# EAGLE board PixHawk_Fire_v1.1 (EAGLE 6.5.0), part 1 of 2
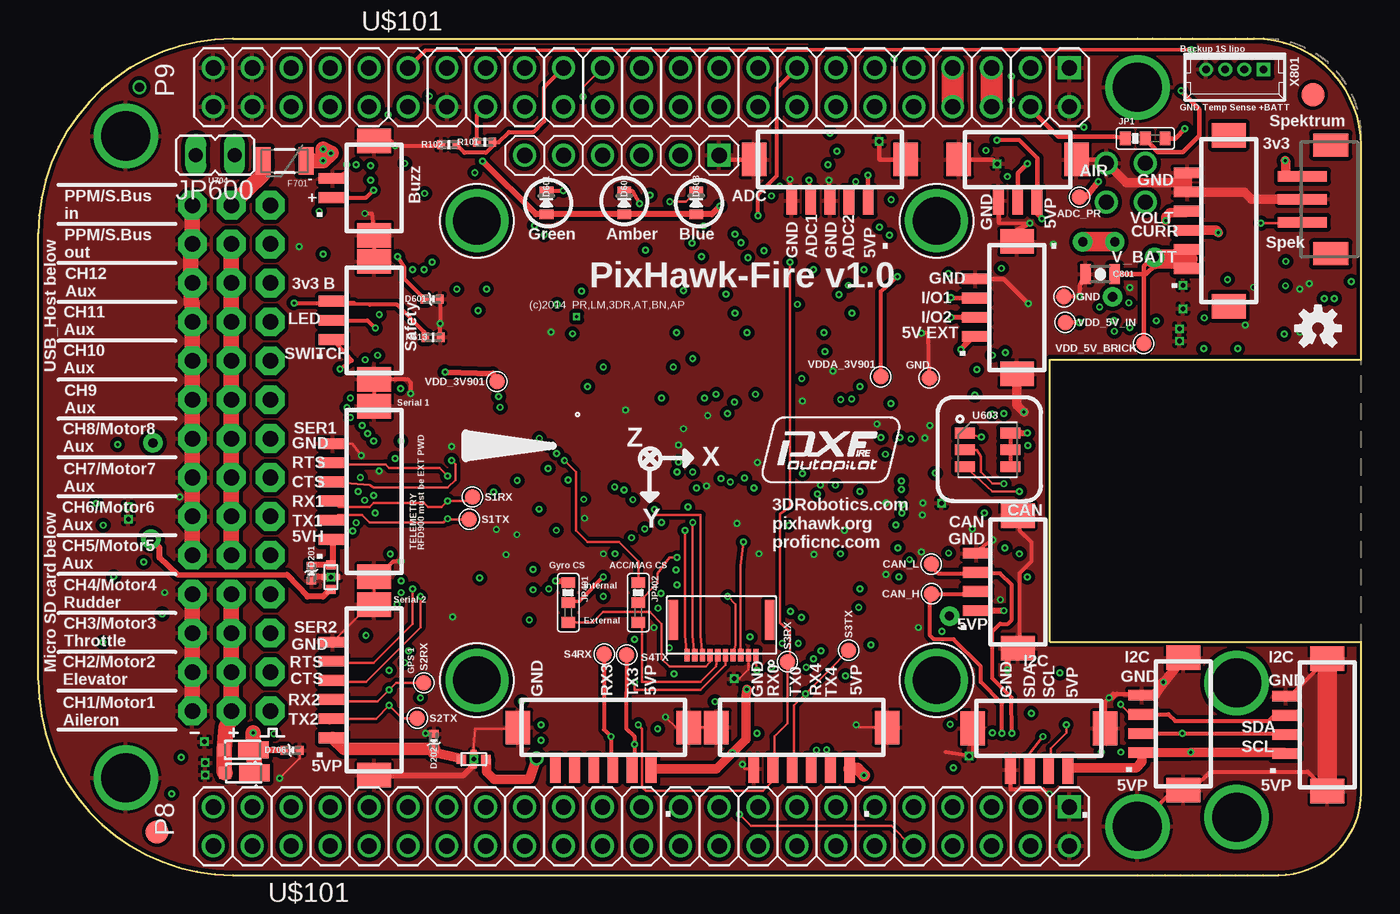
[diagram p9: board, top side]
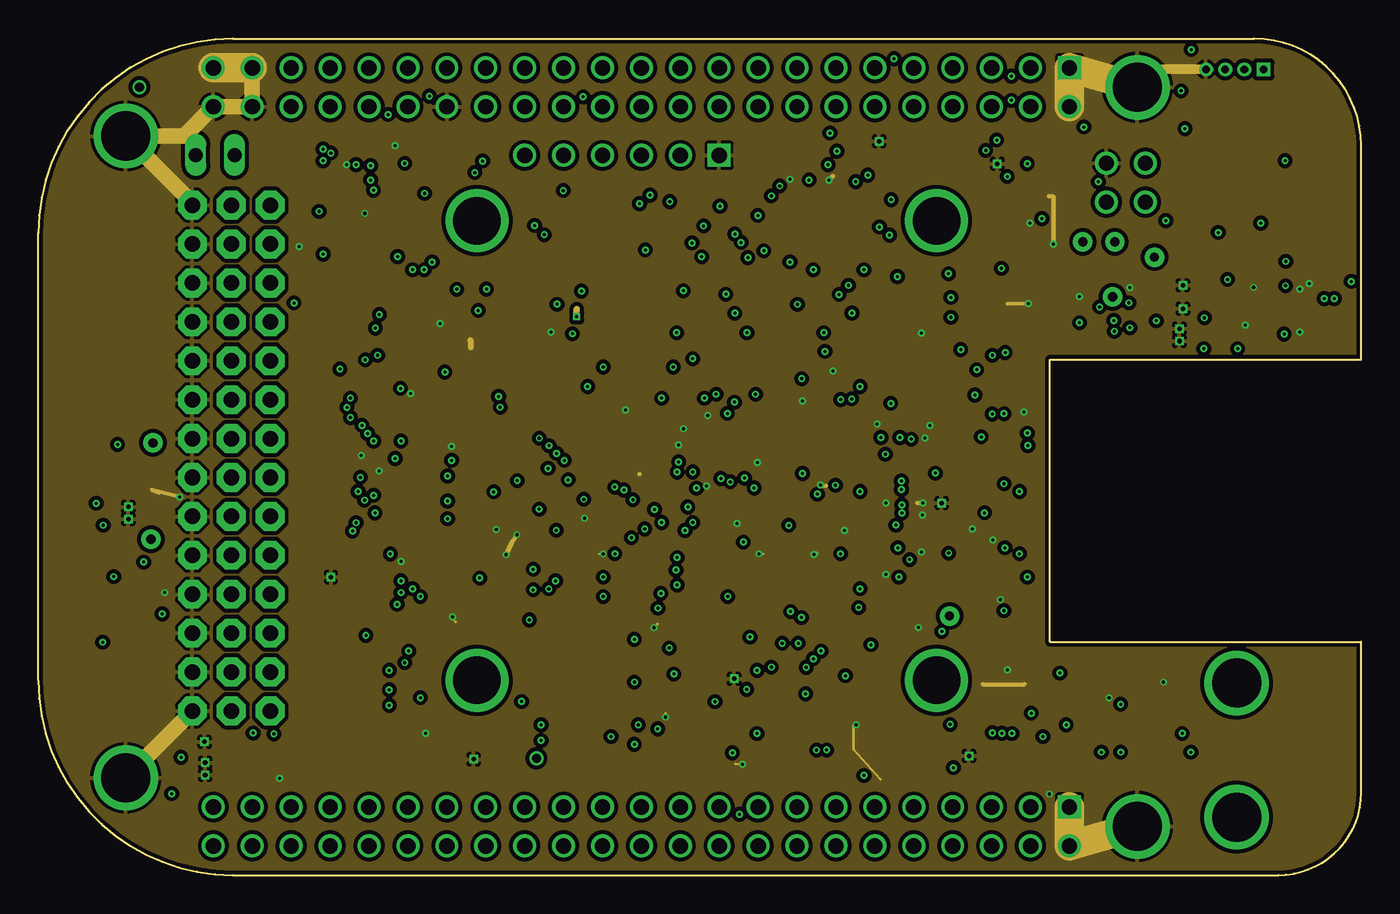
[diagram p10: board, inner layer Ground]
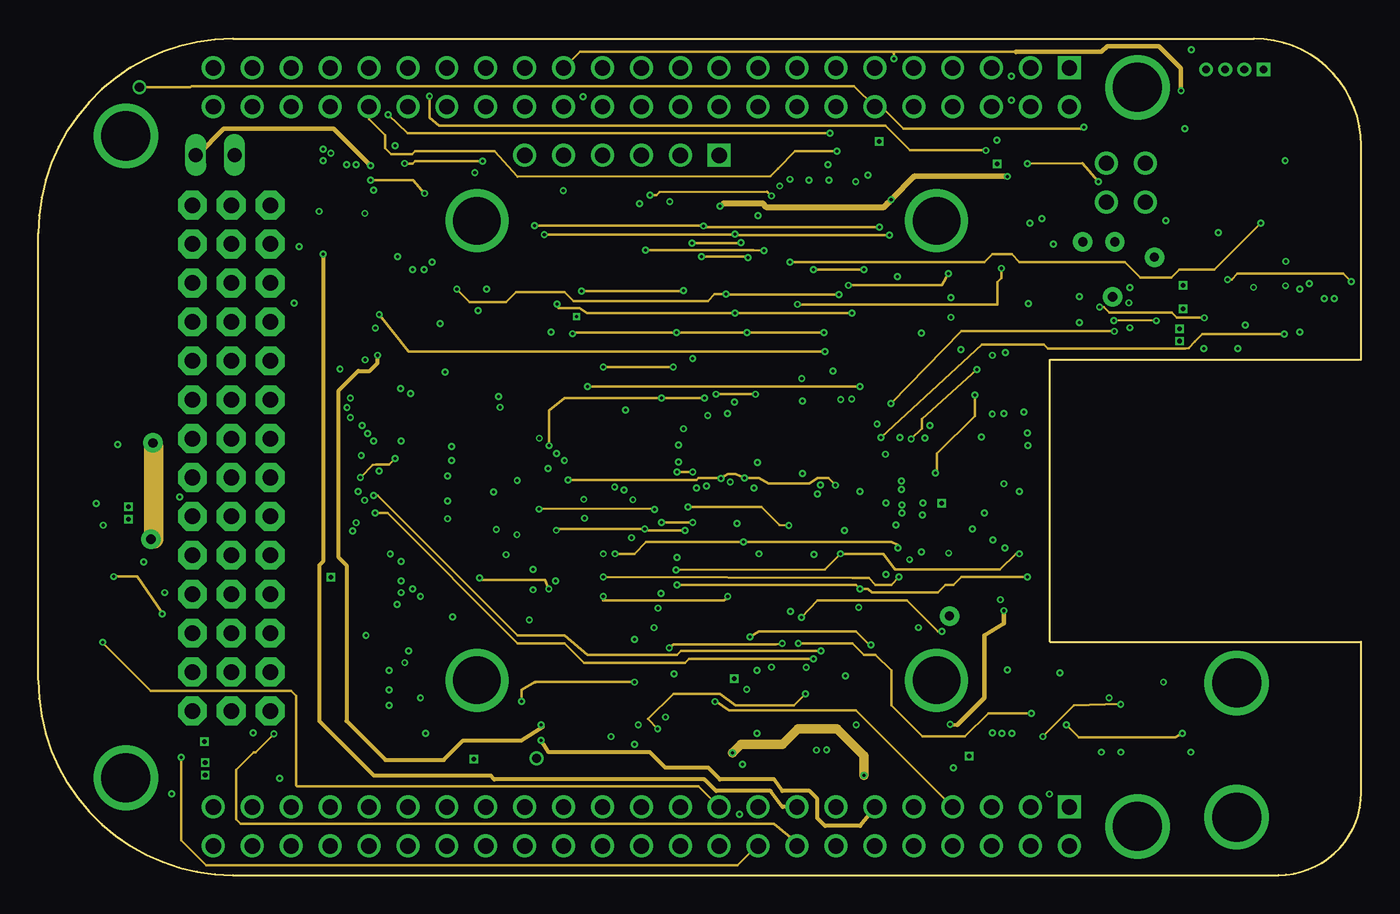
[diagram p11: board, inner layer Horizontal]
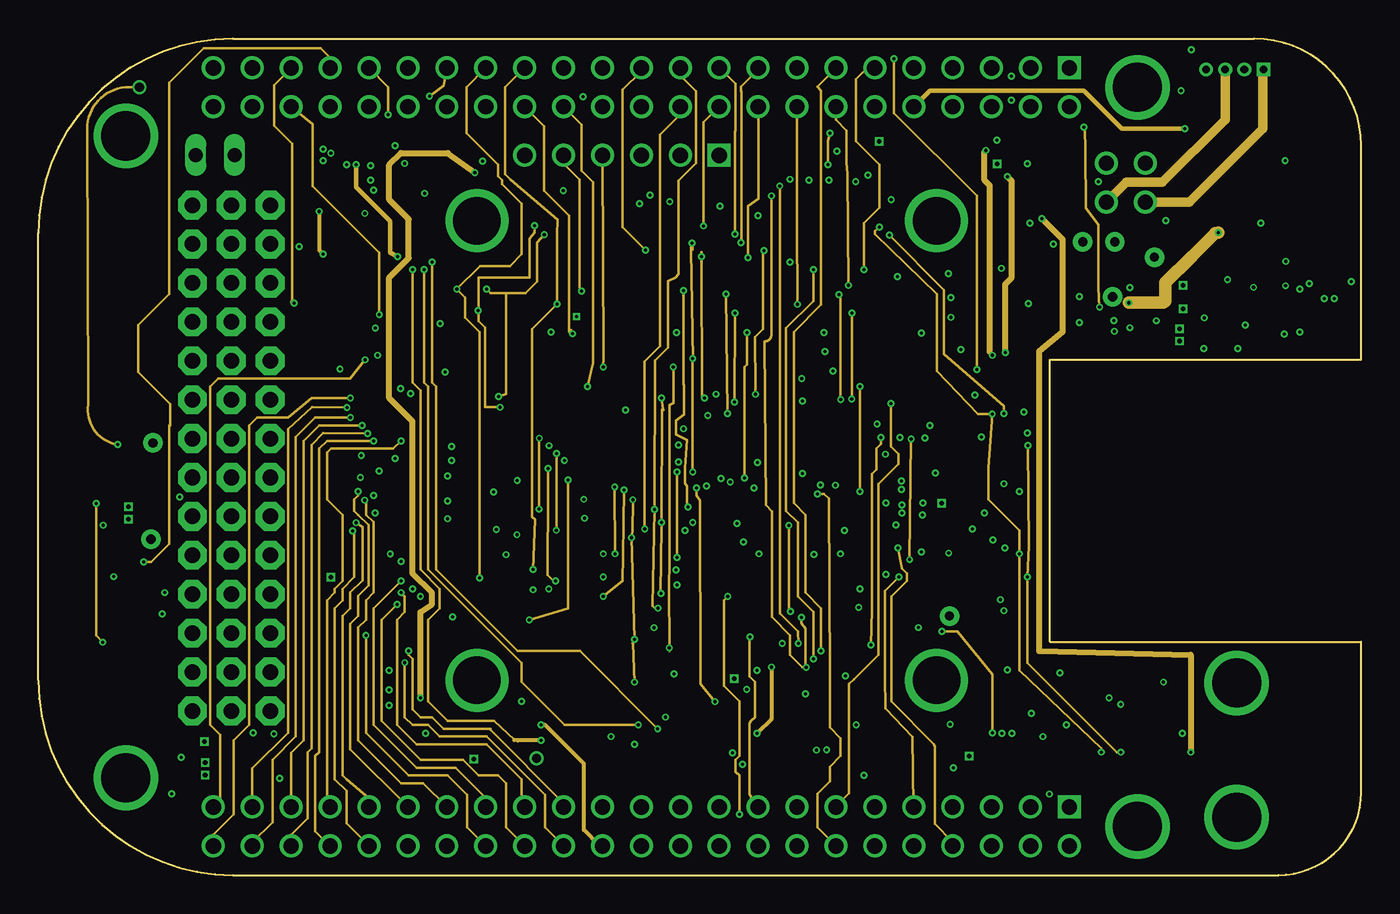
[diagram p12: board, inner layer Vertical]
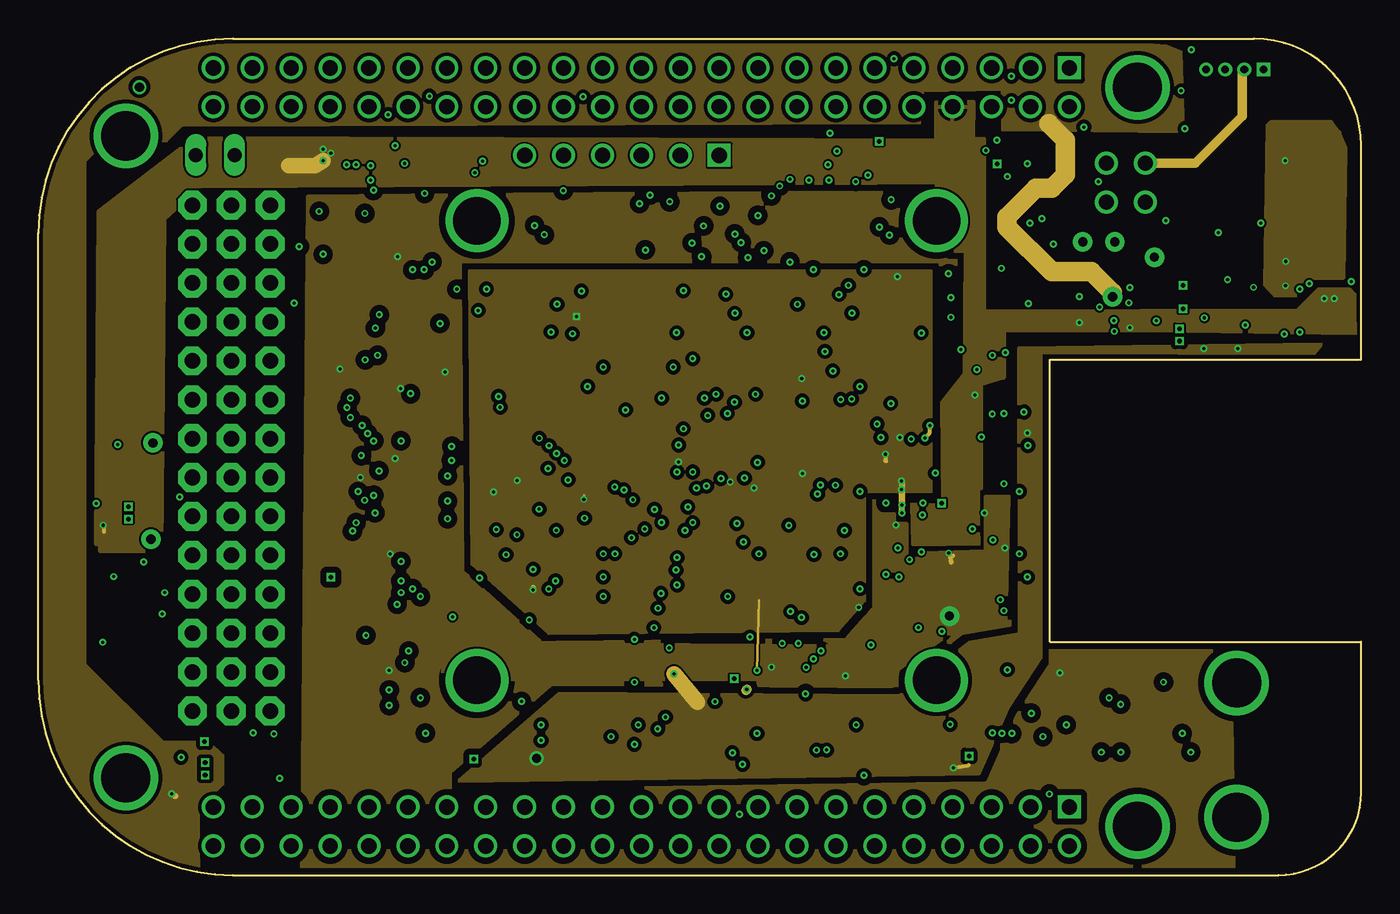
[diagram p13: board, inner layer Power]
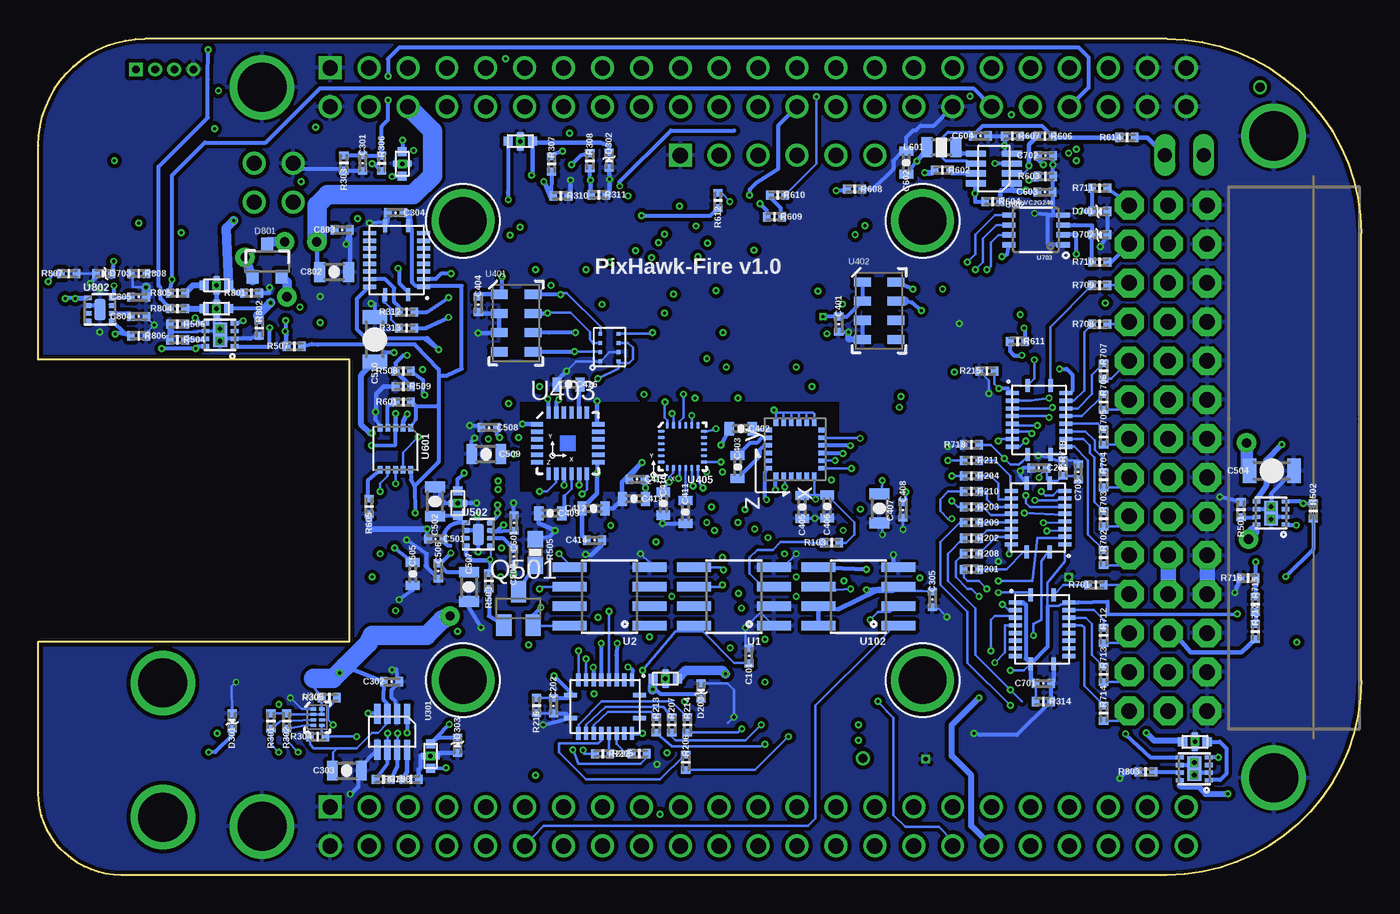
[diagram p14: board, bottom side, seen from below]

Size 86.36 x 54.61 mm. Coordinates in mm from the lower left corner, seen from the top.
Copper layers (1*2*3*14*15*16): Top 0.035mm / dielectric 0.5mm / Ground 0.035mm / dielectric 0.15mm / Horizontal 0.035mm / dielectric 0.15mm / Vertical 0.035mm / dielectric 0.15mm / Power 0.035mm / dielectric 0.5mm / Bottom 0.035mm
Design rules "3DR 5mil *": minimum track width 0.125mm, minimum drill 0.15mm, track to track 4mil, track to pad 4mil, pad to pad 4mil, via to via 4mil, smd to smd 1mil, copper to edge 0.125mm, drill to drill 0.125mm, minimum pad ring 0.125mm, minimum via ring 0.125mm, stop-mask expansion 1mil, vias tented up to drill 0.31mm, thermal gap 8mil
Net classes: 0 signal: width 0.127 mm, drill 0.2 mm, clearance 0.127 mm; 1 power: width 0.127 mm, drill 0.2 mm, clearance 0.127 mm

## Footprints (pad centres in the part's own frame; a part is rotated, then mirrored left to right if it is on the bottom)
PAD.04X.04 = smd 1.016 x 1.016: P$1 0,0
0402-CAP = smd 0.5 x 0.6: P$1 -0.5,0; P$2 0.5,0
0805-CAP = smd 0.7 x 1.3: P$1 -0.95,0; P$2 0.95,0
0603-CAP = smd 0.6 x 0.9: P$1 -0.75,0; P$2 0.75,0
1206-CAP = smd 0.9 x 1.6: P$1 -1.45,0; P$2 1.45,0
0402-TVS = smd 0.5 x 0.6: A 0.5,0; C -0.5,0
MICROSMP = smd 0.8 x 0.8: ANODE 0.65,0 | smd 2 x 1.1: CATHODE -1.25,0
SOT23-3 = smd 0.8 x 0.9: 1 -0.95,-1; 2 0.95,-1; 3 0,1.1
PTC-1206 = smd 1 x 1.8: 1 -1.4,0; 2 1.4,0
51281-1094 = smd 0.34 x 0.8: 1 0,0; 2 0.5,0; 3 1,0; 4 1.5,0; 5 2,0; 6 2.5,0; 7 3,0; 8 3.5,0; 9 4,0; 10 4.5,0 | smd 0.6 x 2.6: P$11 -0.9,-2.3; P$12 5.4,-2.3
DF13C-3P-1.25V = smd 0.7 x 1.8: 1 -1.25,0.9; 2 0,0.9; 3 1.25,0.9 | smd 1.6 x 2.2: P$4 -3.85,-1.8; P$5 3.85,-1.8
DF13C-4P-1.25V = smd 0.7 x 1.8: 1 -1.875,0.9; 2 -0.625,0.9; 3 0.625,0.9; 4 1.875,0.9 | smd 1.6 x 2.2: P$5 -4.325,-1.8; P$6 4.325,-1.8
DF13C-5P-1.25V = smd 0.7 x 1.8: 1 -2.5,0.9; 2 -1.25,0.9; 3 0,0.9; 4 1.25,0.9; 5 2.5,0.9 | smd 1.6 x 2.2: P$6 -4.95,-1.8; P$7 4.95,-1.8
JST-ZH-SMT-VERTICAL = smd 0.7 x 3.2: P$1 -1.5,-1.75; P$2 0,-1.75; P$3 1.5,-1.75 | smd 1.5 x 2.3: P$4 3.55,0.1; P$5 -3.55,0.1
DF13C-6P-1.25V = smd 0.7 x 1.8: 1 -3.125,0.9; 2 -1.875,0.9; 3 -0.625,0.9; 4 0.625,0.9; 5 1.875,0.9; 6 3.125,0.9 | smd 1.6 x 2.2: M$0 5.575,-1.8; M$1 -5.575,-1.8
SJ_3_0603_PASTE1&2 = smd 0.7 x 0.9: 1 -0.65,0; 2 0.65,0; 3 1.95,0
JP1 = drill 0.914 long: 1 0,-1.27; 2 0,1.27
FIDUCIAL-1.5X3 = smd 1.5 x 1.5: 1 0,0
KYOCERA-KNH16-DA = smd 0.6 x 0.6: P$1 -0.8,0; P$2 0.8,0 | smd 0.4 x 0.4: P$3 0,-0.4; P$4 0,0.4 | drill 0.3 pad 0.4 square: P$5 0,0
0805-IND = smd 0.7 x 1.3: P$1 -0.95,0; P$2 0.95,0
0603-LED = smd 0.6 x 0.9: A 0.75,0; C -0.75,0
MOUNT-HOLE3.1 = drill 3.1 pad 4.1: P$1 0,0
SOT23-BEC = smd 1 x 1.4: B -0.95,-1.1; C 0,1.1; E 0.95,-1.1
0402-RES = smd 0.5 x 0.6: P$1 -0.5,0; P$2 0.5,0
0603-RES = smd 1.1 x 1: 1 -0.85,0; 2 0.85,0
SO08 = smd 0.61 x 2.21: 1 -1.905,-2.616; 2 -0.635,-2.616; 3 0.635,-2.616; 4 1.905,-2.616; 5 1.905,2.616; 6 0.635,2.616; 7 -0.635,2.616; 8 -1.905,2.616
QFN20-RGY = smd 0.28 x 0.85: 1 -0.75,2.25; 10 -0.75,-2.25; 11 0.75,-2.25; 20 0.75,2.25 | smd 0.85 x 0.28: 2 -1.75,1.75; 3 -1.75,1.25; 4 -1.75,0.75; 5 -1.75,0.25; 6 -1.75,-0.25; 7 -1.75,-0.75; 8 -1.75,-1.25; 9 -1.75,-1.75; 12 1.75,-1.75; 13 1.75,-1.25; 14 1.75,-0.75; 15 1.75,-0.25; 16 1.75,0.25; 17 1.75,0.75; 18 1.75,1.25; 19 1.75,1.75
SOT23-8 = smd 0.42 x 1.3: 1 -0.975,-1.175; 2 -0.325,-1.175; 3 0.325,-1.175; 4 0.975,-1.175; 5 0.975,1.175; 6 0.325,1.175; 7 -0.325,1.175; 8 -0.975,1.175
PCA9306 = smd 0.35 x 0.2: 1 -0.275,0.525; 2 -0.275,0.175; 3 -0.275,-0.175; 4 -0.275,-0.525; 5 0.275,-0.525; 6 0.275,-0.175; 7 0.275,0.175; 8 0.275,0.525
MS5611-01BA = smd 1.1 x 0.6: 1 -1.1,1.875; 2 -1.1,0.625; 3 -1.1,-0.625; 4 -1.1,-1.875; 5 1.1,-1.875; 6 1.1,-0.625; 7 1.1,0.625; 8 1.1,1.875
QFN-24 = smd 0.8 x 0.29: 1 -2,1.25; 2 -2,0.75; 3 -2,0.25; 4 -2,-0.25; 5 -2,-0.75; 6 -2,-1.25; 13 2,-1.25; 14 2,-0.75; 15 2,-0.25; 16 2,0.25; 17 2,0.75; 18 2,1.25 | smd 0.29 x 0.8: 7 -1.25,-2; 8 -0.75,-2; 9 -0.25,-2; 10 0.25,-2; 11 0.75,-2; 12 1.25,-2; 19 1.25,2; 20 0.75,2; 21 0.25,2; 22 -0.25,2; 23 -0.75,2; 24 -1.25,2
MPU-6500 = smd 0.45 x 0.22: 1 -1.4,1; 2 -1.4,0.6; 3 -1.4,0.2; 4 -1.4,-0.2; 5 -1.4,-0.6; 6 -1.4,-1; 13 1.4,-1; 14 1.4,-0.6; 15 1.4,-0.2; 16 1.4,0.2; 17 1.4,0.6; 18 1.4,1 | smd 0.22 x 0.45: 7 -1,-1.4; 8 -0.6,-1.4; 9 -0.2,-1.4; 10 0.2,-1.4; 11 0.6,-1.4; 12 1,-1.4; 19 1,1.4; 20 0.6,1.4; 21 0.2,1.4; 22 -0.2,1.4; 23 -0.6,1.4; 24 -1,1.4
LSM9DS0 = smd 0.45 x 0.3: 1 -1.75,1.25; 2 -1.75,0.75; 3 -1.75,0.25; 4 -1.75,-0.25; 5 -1.75,-0.75; 6 -1.75,-1.25; 13 1.75,-1.25; 14 1.75,-0.75; 15 1.75,-0.25; 16 1.75,0.25; 17 1.75,0.75; 18 1.75,1.25 | smd 0.3 x 0.45: 7 -1.25,-1.75; 8 -0.75,-1.75; 9 -0.25,-1.75; 10 0.25,-1.75; 11 0.75,-1.75; 12 1.25,-1.75; 19 1.25,1.75; 20 0.75,1.75; 21 0.25,1.75; 22 -0.25,1.75; 23 -0.75,1.75; 24 -1.25,1.75
BMP280_PRELIM = smd 0.25 x 0.25: P$1 0.6,0.9; P$2 0.6,0.3; P$3 0.6,-0.3; P$4 0.6,-0.9; P$5 -0.6,-0.9; P$6 -0.6,-0.3; P$7 -0.6,0.3; P$8 -0.6,0.9
QFN8-DSG = smd 0.28 x 0.5: 1 -0.75,-0.95; 2 -0.25,-0.95; 3 0.25,-0.95; 4 0.75,-0.95; 5 0.75,0.95; 6 0.25,0.95; 7 -0.25,0.95; 8 -0.75,0.95 | smd 1.6 x 0.9: GND 0,0 | drill 0.3 square: P$2 -0.4,0; P$3 0.4,0
MLF-8-EPAD = smd 0.5 x 0.3: 1 -0.8,0.75; 2 -0.8,0.25; 3 -0.8,-0.25; 4 -0.8,-0.75; 5 0.8,-0.75; 6 0.8,-0.25; 7 0.8,0.25; 8 0.8,0.75 | smd 0.7 x 1.4: GND 0,0
SON10 = smd 0.32 x 0.5: 1 -1,-1.375; 2 -0.5,-1.375; 3 0,-1.375; 4 0.5,-1.375; 5 1,-1.375; 6 1,1.375; 7 0.5,1.375; 8 0,1.375; 9 -0.5,1.375; 10 -1,1.375
6-PLCC = smd 1.3 x 0.7: A1 1.475,1.1; A2 1.475,0; A3 1.475,-1.1; C1 -1.475,1.1; C2 -1.475,0; C3 -1.475,-1.1
TSSOP8_SOT505-2 = smd 0.35 x 0.85: 1 -0.975,-1.775; 2 -0.325,-1.775; 3 0.325,-1.775; 4 0.975,-1.775; 5 0.975,1.775; 6 0.325,1.775; 7 -0.325,1.775; 8 -0.975,1.775
3X14RA = drill 1.016 pad 1.88 octagon: 1 2.54,-16.51; 2 0,-16.51; 3 -2.54,-16.51; 4 2.54,-13.97; 5 0,-13.97; 6 -2.54,-13.97; 7 2.54,-11.43; 8 0,-11.43; 9 -2.54,-11.43; 10 2.54,-8.89; 11 0,-8.89; 12 -2.54,-8.89; 13 2.54,-6.35; 14 0,-6.35; 15 -2.54,-6.35; 16 2.54,-3.81; 17 0,-3.81; 18 -2.54,-3.81; 19 2.54,-1.27; 20 0,-1.27; 21 -2.54,-1.27; 22 2.54,1.27; 23 0,1.27; 24 -2.54,1.27; 25 2.54,3.81; 26 0,3.81; 27 -2.54,3.81; 28 2.54,6.35; 29 0,6.35; 30 -2.54,6.35; 31 2.54,8.89; 32 0,8.89; 33 -2.54,8.89; 34 2.54,11.43; 35 0,11.43; 36 -2.54,11.43; 37 2.54,13.97; 38 0,13.97; 39 -2.54,13.97; 40 2.54,16.51; 41 0,16.51; 42 -2.54,16.51
DF13C-6P-1.25V' = smd 0.7 x 1.8: 1 -3.125,0.9; 2 -1.875,0.9; 3 -0.625,0.9; 4 0.625,0.9; 5 1.875,0.9; 6 3.125,0.9 | smd 1.6 x 2.2: P$7 -5.575,-1.8; P$8 5.575,-1.8
DF13C-2P-1.25V = smd 0.7 x 1.8: 1 -0.625,0.9; 2 0.625,0.9 | smd 1.6 x 2.2: P$3 -3.075,-1.8; P$4 3.075,-1.8
BEAGLEBONE_SHIELD = drill 1 square: 1 4.445,19.05; 47 52.705,19.05; 93 46.99,41.91 | drill 1: 2 1.905,19.05; 3 4.445,21.59; 4 1.905,21.59; 5 4.445,24.13; 6 1.905,24.13; 7 4.445,26.67; 8 1.905,26.67; 9 4.445,29.21; 10 1.905,29.21; 11 4.445,31.75; 12 1.905,31.75; 13 4.445,34.29; 14 1.905,34.29; 15 4.445,36.83; 16 1.905,36.83; 17 4.445,39.37; 18 1.905,39.37; 19 4.445,41.91; 20 1.905,41.91; 21 4.445,44.45; 22 1.905,44.45; 23 4.445,46.99; 24 1.905,46.99; 25 4.445,49.53; 26 1.905,49.53; 27 4.445,52.07; 28 1.905,52.07; 29 4.445,54.61; 30 1.905,54.61; 31 4.445,57.15; 32 1.905,57.15; 33 4.445,59.69; 34 1.905,59.69; 35 4.445,62.23; 36 1.905,62.23; 37 4.445,64.77; 38 1.905,64.77; 39 4.445,67.31; 40 1.905,67.31; 41 4.445,69.85; 42 1.905,69.85; 43 4.445,72.39; 44 1.905,72.39; 45 4.445,74.93; 46 1.905,74.93; 48 50.165,19.05; 49 52.705,21.59; 50 50.165,21.59; 51 52.705,24.13; 52 50.165,24.13; 53 52.705,26.67; 54 50.165,26.67; 55 52.705,29.21; 56 50.165,29.21; 57 52.705,31.75; 58 50.165,31.75; 59 52.705,34.29; 60 50.165,34.29; 61 52.705,36.83; 62 50.165,36.83; 63 52.705,39.37; 64 50.165,39.37; 65 52.705,41.91; 66 50.165,41.91; 67 52.705,44.45; 68 50.165,44.45; 69 52.705,46.99; 70 50.165,46.99; 71 52.705,49.53; 72 50.165,49.53; 73 52.705,52.07; 74 50.165,52.07; 75 52.705,54.61; 76 50.165,54.61; 77 52.705,57.15; 78 50.165,57.15; 79 52.705,59.69; 80 50.165,59.69; 81 52.705,62.23; 82 50.165,62.23; 83 52.705,64.77; 84 50.165,64.77; 85 52.705,67.31; 86 50.165,67.31; 87 52.705,69.85; 88 50.165,69.85; 89 52.705,72.39; 90 50.165,72.39; 91 52.705,74.93; 92 50.165,74.93; 94 46.99,44.45; 95 46.99,46.99; 96 46.99,49.53; 97 46.99,52.07; 98 46.99,54.61; TP5 43.942,14.097; TP6 46.482,14.097; TP7 43.942,16.637; TP8 46.482,16.637 | drill 3.2: P$1 6.35,80.645; P$2 48.26,80.645; P$3 3.175,14.605; P$4 51.435,14.605 | drill 3.2 pad 3.81: P$5 12.54,8.128; P$6 3.78,8.128
53047-04 = drill 0.5 pad 0.9 square: 1 -1.875,0 | drill 0.5 pad 0.9: 2 -0.625,0; 3 0.625,0; 4 1.875,0

## Placement (x,y rotation side)
ADC_PR  PAD.04  [PAD.04X.04]  67.97,44.26 90 top
C101  0u1  [0402-CAP]  39.96,14.32 90 bottom
C201  0u1  [0402-CAP]  21.03,26.59 180 bottom
C202  0u1  [0402-CAP]  52.73,11.06 270 bottom
C301  0u1  [0402-CAP]  65.19,46.48 270 bottom
C302  0u1  [0402-CAP]  63.29,12.63 0 bottom
C303  10u/10V  [0805-CAP]  66.22,6.82 0 bottom
C304  0u1  [0402-CAP]  63.03,43.24 180 bottom
C305  0u1  [0402-CAP]  27.99,18 270 bottom
C401  0u1  [0402-CAP]  34.11,35.96 270 bottom
C402  4.7u  [0603-CAP]  40.5,29.14 180 bottom
C403  0.22u  [0603-CAP]  40.71,26.65 270 bottom
C404  0u1  [0402-CAP]  57.64,37.26 270 bottom
C405  0u1  [0603-CAP]  36.49,24.04 90 bottom
C406  10u  [0603-CAP]  34.86,24.06 90 bottom
C407  10u/10V  [0805-CAP]  31.45,23.94 270 bottom
C408  0u1  [0402-CAP]  29.91,23.84 270 bottom
C409  2200p  [0603-CAP]  52.94,23.61 180 bottom
C410  10n  [0603-CAP]  45.56,24.25 270 bottom
C411  2200p  [0603-CAP]  44.12,23.71 270 bottom
C412  2u2  [0603-CAP]  50.11,23.93 0 bottom
C413  2u2  [0603-CAP]  47.48,24.56 180 bottom
C414  2200p  [0402-CAP]  50.06,21.86 0 bottom
C415  u1F  [0402-CAP]  47.29,25.84 180 bottom
C416  2200p  [0603-CAP]  51.75,32.03 180 bottom
C501  0u1  [0402-CAP]  60.42,21.94 180 bottom
C502  10u  [0805-CAP]  60.46,24.38 90 bottom
C503  10n  [0402-CAP]  55.33,20.79 90 bottom
C504  100u  [1206-CAP]  5.84,26.39 0 bottom
C505  1u  [0603-CAP]  61.92,19.65 270 bottom
C506  0u1  [0402-CAP]  60.24,19.85 270 bottom
C507  22u  [0805-CAP]  58.24,18.82 270 bottom
C508  0u1  [0402-CAP]  56.93,29.21 180 bottom
C509  22u  [0805-CAP]  57.12,27.48 180 bottom
C510  100u  [1206-CAP]  64.38,34.98 90 bottom
C601  0u1  [0402-CAP]  55.31,22.99 90 bottom
C602  1u0  [0603-CAP]  29.69,46.51 90 bottom
C603  5n6  [0402-CAP]  20.64,44.6 0 bottom
C604  0u47  [0402-CAP]  24.85,48.25 0 bottom
C701  0u1  [0402-CAP]  20.75,12.51 0 bottom
C702  0u1  [0402-CAP]  20.61,46.98 0 bottom
C703  0u1  [0402-CAP]  18.47,26.33 90 bottom
C801  22u/25V  [0805-CAP]  69.32,39.23 180 top
C802  10u/25V  [0805-CAP]  67.05,39.38 0 bottom
C803  0u1F  [0402-CAP]  66.51,42.12 0 bottom
C804  10n  [0402-CAP]  79.81,36.47 0 bottom
C805  2u2  [0402-CAP]  79.81,37.74 0 bottom
CAN_H  PAD.04  [PAD.04X.04]  58.32,18.36 180 top
CAN_L  PAD.04  [PAD.04X.04]  58.29,20.31 180 top
D201  PESD0402-140  [0402-TVS]  17.83,19.71 270 top
D202  PESD0402-140  [0402-TVS]  25.83,8.73 90 top
D203  PESD0402-140  [0402-TVS]  43.09,12.01 90 bottom
D301  PESD0402-140  [0402-TVS]  73.71,10.06 90 bottom
D302  PESD0402-140  [0402-TVS]  49.11,46.68 270 bottom
D303  PESD0402-140  [0402-TVS]  59,8.48 270 bottom
D601  PESD0402-140  [0402-TVS]  25.72,37.61 0 top
D701  PESD0402-140  [0402-TVS]  17.07,43.33 0 bottom
D702  PESD0402-140  [0402-TVS]  17.07,41.81 0 bottom
D703  PESD0402-140  [0402-TVS]  82.09,39.27 180 bottom
D704  DIODE-SCHOTTKY_MSMP  [MICROSMP]  12.79,8.18 180 top
D705  DIODE-SCHOTTKY_MSMP  [MICROSMP]  12.85,6.67 180 top
D706  PESD0402-140  [0402-TVS]  16.56,8.15 0 top
D801  PMEG2005CT  [SOT23-3]  71.42,40.06 0 bottom
F701  0ZCA0035FF2G  [PTC-1206]  16.08,46.62 180 top
FPC_401  CONN_FPC_10RA  [51281-1094]  46.85,14.35 180 top
GND  PAD.04  [PAD.04X.04]  66.96,37.76 0 top
GND.  PAD.04  [PAD.04X.04]  58.16,32.46 90 top
J305  DF13-3P-1.25V  [DF13C-3P-1.25V]  63.93,44.92 180 top
J306  DF13-4P-1.25V  [DF13C-4P-1.25V]  72.95,9.87 90 top
J307  DF13-4P-1.25V  [DF13C-4P-1.25V]  62.15,19.14 90 top
J308  DF13-4P-1.25V  [DF13C-4P-1.25V]  62.09,37.05 90 top
J309  DF13-5P-1.25V  [DF13C-5P-1.25V]  51.68,44.92 180 top
J310  DF13-4P-1.25V  [DF13C-4P-1.25V]  82.35,9.8 90 top
J314  DF13-4P-1.25V  [DF13C-4P-1.25V]  65.33,7.77 180 top
J701  JST-ZH-3  [JST-ZH-SMT-VERTICAL]  84.28,44.12 270 top
J801  DF13C-6P-1.25V  [DF13C-6P-1.25V]  75.92,42.72 90 top
JP1  JUMPER-30603  [SJ_3_0603_PASTE1&2]  71.62,48.09 0 top
JP401  JUMPER-30603  [SJ_3_0603_PASTE1&2]  34.59,18.44 270 top
JP402  JUMPER-30603  [SJ_3_0603_PASTE1&2]  39.17,18.44 270 top
JP600  [JP1]  11.54,47.02 90 top
JP901  FIDUCIAL1.5X3  [FIDUCIAL-1.5X3]  83.21,50.95 0 top
JP902  FIDUCIAL1.5X3  [FIDUCIAL-1.5X3]  7.76,2.82 0 top
L201  KNH16C104DA5TS  [KYOCERA-KNH16-DA]  19.1,19.46 90 top
L202  KNH16C104DA5TS  [KYOCERA-KNH16-DA]  28.42,7.56 180 top
L203  KNH16C104DA5TS  [KYOCERA-KNH16-DA]  45.42,12.82 180 bottom
L301  KNH16C104DA5TS  [KYOCERA-KNH16-DA]  62.6,46.44 90 bottom
L302  KNH16C104DA5TS  [KYOCERA-KNH16-DA]  54.89,47.91 0 bottom
L303  KNH16C104DA5TS  [KYOCERA-KNH16-DA]  60.76,7.77 90 bottom
L501  KNH16C104DA5TS  [KYOCERA-KNH16-DA]  58.97,24.28 270 bottom
L601  47uH  [0805-IND]  27.41,47.52 0 bottom
L701  KNH16C104DA5TS  [KYOCERA-KNH16-DA]  10.86,8.7 0 bottom
L801  KNH16C104DA5TS  [KYOCERA-KNH16-DA]  74.73,36.98 180 bottom
L802  KNH16C104DA5TS  [KYOCERA-KNH16-DA]  74.73,38.51 180 bottom
LED601  GREEN  [0603-LED]  33.17,43.89 270 top
LED602  AMBER  [0603-LED]  38.25,43.89 270 top
LED603  BLUE  [0603-LED]  42.95,43.89 270 top
M3_MOUNT901  MOUNT-HOLE3.1MM  [MOUNT-HOLE3.1]  28.64,42.72 0 top
M3_MOUNT902  MOUNT-HOLE3.1MM  [MOUNT-HOLE3.1]  58.64,12.72 0 top
M3_MOUNT903  MOUNT-HOLE3.1MM  [MOUNT-HOLE3.1]  58.64,42.72 0 top
M3_MOUNT904  MOUNT-HOLE3.1MM  [MOUNT-HOLE3.1]  28.64,12.72 0 top
OSHW_LOGO  OSHW-LOGOS  [OSHW-LOGO-S]  83.54,35.7 0 top
Q501  MMBT3906LT1SMD  [SOT23-BEC]  55.01,17.41 0 bottom
R101  0R/0.1%  [0402-RES]  29.14,47.85 0 top
R102  10M/0.1%  [0402-RES]  26.79,47.69 0 top
R103  4.75K/0.1%  [0402-RES]  34.57,21.7 0 bottom
R201  120R  [0402-RES]  25.45,19.96 180 bottom
R202  120R  [0402-RES]  25.45,22 180 bottom
R203  120R  [0402-RES]  25.45,24.03 180 bottom
R204  120R  [0402-RES]  25.45,26.06 180 bottom
R205  120R  [0402-RES]  47.13,7.93 0 bottom
R206  120R  [0402-RES]  44.09,7.36 270 bottom
R207  120R  [0402-RES]  45.01,9.8 270 bottom
R208  120R  [0402-RES]  25.45,20.98 180 bottom
R209  120R  [0402-RES]  25.45,23.01 180 bottom
R210  120R  [0402-RES]  25.45,25.04 180 bottom
R211  120R  [0402-RES]  25.45,27.08 180 bottom
R212  120R  [0402-RES]  49.52,7.91 180 bottom
R213  120R  [0402-RES]  46.02,9.8 270 bottom
R214  120R  [0402-RES]  43.99,9.8 270 bottom
R215  10K  [0402-RES]  24.43,32.92 0 bottom
R216  10K  [0402-RES]  53.84,11.07 90 bottom
R301  1K5  [0402-RES]  71.17,10.06 90 bottom
R302  1K5  [0402-RES]  70.15,10.06 90 bottom
R303  10K/0.1%  [0402-RES]  66.41,46.49 90 bottom
R304  1K5  [0402-RES]  68.12,9.04 0 bottom
R305  1K5  [0402-RES]  67.36,11.58 0 bottom
R306  10K/0.1%  [0402-RES]  63.95,46.47 270 bottom
R307  10K/0.1%  [0402-RES]  52.85,46.43 270 bottom
R308  10K/0.1%  [0402-RES]  50.36,46.64 270 bottom
R309  120R  [0402-RES]  63.84,6.25 180 bottom
R310  10K/0.1%  [0402-RES]  52.25,44.35 180 bottom
R311  10K/0.1%  [0402-RES]  49.77,44.41 180 bottom
R312  220R  [0402-RES]  62.32,36.76 0 bottom
R313  220R  [0402-RES]  62.32,35.71 0 bottom
R314  10K  [0402-RES]  20.75,11.33 180 bottom
R315  0R  [0402-RES]  62.03,6.25 0 bottom
R501  16K5  [0402-RES]  7.84,23.86 90 bottom
R502  1M  [0402-RES]  3.13,23.77 270 bottom
R503  1k8  [0402-RES]  56.95,19.2 90 bottom
R504  25K  [0402-RES]  77.27,34.95 180 bottom
R505  10R  [0603-RES]  53.91,21.08 270 bottom
R506  10K  [0402-RES]  77.27,35.97 180 bottom
R507  1M  [0402-RES]  69.64,34.53 0 bottom
R508  10K/0.1%  [0402-RES]  62.53,32.92 0 bottom
R509  10K/0.1%  [0402-RES]  62.53,31.9 180 bottom
R601  220R  [0402-RES]  62.53,30.89 0 bottom
R602  9K09  [0402-RES]  27.34,46.02 180 bottom
R603  10K  [0402-RES]  20.62,45.62 0 bottom
R604  100K  [0402-RES]  24.05,43.97 180 bottom
R605  10K  [0402-RES]  64.77,24.06 90 bottom
R606  453K  [0402-RES]  20.65,48.23 180 bottom
R607  16K5  [0402-RES]  22.77,48.24 180 bottom
R608  220R  [0402-RES]  33.07,44.78 180 bottom
R609  220R  [0402-RES]  38.3,42.98 180 bottom
R610  220R  [0402-RES]  38.1,44.4 180 bottom
R611  68R  [0402-RES]  22.43,34.84 180 bottom
R612  220R  [0402-RES]  41.99,44.04 90 bottom
R613  1K5  [0402-RES]  25.77,35.11 0 top
R614  100K  [0402-RES]  15.29,48.16 0 bottom
R701  220R  [0402-RES]  17.32,18.95 0 bottom
R702  220R  [0402-RES]  16.81,20.73 270 bottom
R703  220R  [0402-RES]  16.81,23.27 270 bottom
R704  220R  [0402-RES]  16.81,25.81 270 bottom
R705  220R  [0402-RES]  16.81,28.6 270 bottom
R706  220R  [0402-RES]  16.81,30.89 270 bottom
R707  220R  [0402-RES]  16.81,32.92 270 bottom
R708  220R  [0402-RES]  17.07,35.97 0 bottom
R709  220R  [0402-RES]  17.07,38.51 0 bottom
R710  220R  [0402-RES]  17.07,40.03 0 bottom
R711  220R  [0402-RES]  17.07,44.86 0 bottom
R712  220R  [0402-RES]  16.81,15.65 270 bottom
R713  220R  [0402-RES]  16.81,13.11 270 bottom
R714  220R  [0402-RES]  16.81,10.57 270 bottom
R715  10K/0.1%  [0402-RES]  6.91,17.68 270 bottom
R716  10K/0.1%  [0402-RES]  7.39,19.39 0 bottom
R717  10K/0.1%  [0402-RES]  6.91,15.9 270 bottom
R718  10K  [0402-RES]  25.45,28.09 0 bottom
R719  10K  [0402-RES]  19.48,26.57 270 bottom
R801  1M  [0402-RES]  72.44,38 0 bottom
R802  1M  [0402-RES]  71.93,35.71 270 bottom
R803  100K  [0402-RES]  14.07,6.74 0 bottom
R804  10K/0.1%  [0402-RES]  77.27,36.98 0 bottom
R805  10K/0.1%  [0402-RES]  77.27,38 0 bottom
R806  10K  [0402-RES]  79.81,35.2 180 bottom
R807  10K/0.1%  [0402-RES]  84.38,39.27 0 bottom
R808  10K/0.1%  [0402-RES]  79.81,39.27 180 bottom
S1RX  PAD.04  [PAD.04X.04]  28.34,24.68 0 top
S1TX  PAD.04  [PAD.04X.04]  28.14,23.23 0 top
S2RX  PAD.04  [PAD.04X.04]  25.17,12.55 90 top
S2TX  PAD.04  [PAD.04X.04]  24.74,10.24 0 top
S3RX  PAD.04  [PAD.04X.04]  48.91,13.93 90 top
S3TX  PAD.04  [PAD.04X.04]  52.9,14.68 90 top
S4RX  PAD.04  [PAD.04X.04]  36.94,14.43 180 top
S4TX  PAD.04  [PAD.04X.04]  38.4,14.38 0 top
U1  EEPROM-I2CSMD  [SO08]  40.94,18.19 90 bottom
U2  EEPROM-I2CSMD  [SO08]  49.07,18.19 90 bottom
U102  FM25V01  [SO08]  32.82,18.19 90 bottom
U201  TXS0108QFN20  [QFN20-RGY]  21.1,23.33 180 bottom
U202  TXS0108QFN20  [QFN20-RGY]  49.35,11.01 270 bottom
U301  MAX3051  [SOT23-8]  63.26,9.36 180 bottom
U302  TXS0108QFN20  [QFN20-RGY]  62.97,40.16 180 bottom
U303  PCA9306  [PCA9306]  68.12,10.31 0 bottom
U401  MS5611-01BA  [MS5611-01BA]  55.17,36.04 0 bottom
U402  MS5611-01BA  [MS5611-01BA]  31.47,36.85 0 bottom
U403  MPU-6000  [QFN-24]  51.8,28.2 0 bottom
U405  MPU-9250  [MPU-6500]  44.29,27.97 0 bottom
U406  LSM9DS0LSM9DS0  [LSM9DS0]  36.96,27.81 270 bottom
U407  BMP280_PRELIM  [BMP280_PRELIM]  49.07,34.44 180 bottom
U501  BQ24315  [QFN8-DSG]  5.88,23.64 90 bottom
U502  MIC5332  [MLF-8-EPAD]  57.64,22.25 0 bottom
U503  BQ24315  [QFN8-DSG]  74.49,35.27 90 bottom
U601  TCA62724FMG  [SON10]  63.04,27.84 180 bottom
U602  LT3469  [SOT23-8]  23.98,46.13 90 bottom
U603  LRTB GFTG-T7AW-1+V7A7-29+R5T9-49-L  [6-PLCC]  61.97,27.77 0 top
U701  TXS0108QFN20  [QFN20-RGY]  20.83,16.05 0 bottom
U702  TXS0108QFN20  [QFN20-RGY]  21.03,29.72 0 bottom
U703  74LVC2G240  [TSSOP8_SOT505-2]  21.23,42.11 90 bottom
U704  BBB_3X14_RA  [3X14RA]  12.6,27.23 0 top
U801  BQ24313  [QFN8-DSG]  10.89,6.94 90 bottom
U802  MIC5332  [MLF-8-EPAD]  82.32,36.93 0 bottom
U$1  PX4-LOGO  [PIXHAWK-FIRE-LOGO-30]  46.17,25.16 0 top
U$2  DF13-6P-1.25V  [DF13C-6P-1.25V']  20.12,12.09 90 top
U$3  DF13-6P-1.25V  [DF13C-6P-1.25V']  36.88,7.84 180 top
U$4  DF13-6P-1.25V  [DF13C-6P-1.25V']  49.83,7.84 180 top
U$5  CREATIVE_COMMONS  [CREATIVE_COMMONS]  17.32,-18.64 0 top  (outside the outline)
U$6  CREATIVE_COMMONS  [CREATIVE_COMMONS]  17.32,-10.01 0 top  (outside the outline)
U$7  CREATIVE_COMMONS  [CREATIVE_COMMONS]  17.32,-27.28 0 top  (outside the outline)
U$8  CREATIVE_COMMONS  [CREATIVE_COMMONS]  17.32,-35.92 0 top  (outside the outline)
U$9  CREATIVE_COMMONS  [CREATIVE_COMMONS]  17.32,-44.55 0 top  (outside the outline)
U$10  CREATIVE_COMMONS  [CREATIVE_COMMONS]  17.32,-53.19 0 top  (outside the outline)
U$11  DF13-2P-1.25  [DF13C-2P-1.25V]  20.12,44.86 90 top
U$12  DF13-3P-1.25V  [DF13C-3P-1.25V]  20.12,36.22 90 top
U$13  CREATIVE_COMMONS  [CREATIVE_COMMONS]  17.32,-61.82 0 top  (outside the outline)
U$14  CREATIVE_COMMONS  [CREATIVE_COMMONS]  17.32,-70.46 0 top  (outside the outline)
U$15  CREATIVE_COMMONS  [CREATIVE_COMMONS]  17.32,-79.1 0 top  (outside the outline)
U$101  BEAGLEBONE_OUTLINE  [BEAGLEBONE_SHIELD]  86.36,0 90 top
U$201  DF13-6P-1.25V  [DF13C-6P-1.25V']  20.12,25.04 90 top
VDD_3V901  PAD.04  [PAD.04X.04]  29.94,32.22 270 top
VDD_5V_BRICK  PAD.04  [PAD.04X.04]  72.16,34.7 90 top
VDD_5V_IN  PAD.04  [PAD.04X.04]  67.03,36.09 0 top
VDDA_3V901  PAD.04  [PAD.04X.04]  55,32.54 90 top
X801  4 pin head  [53047-04]  78.1,52.6 180 top

## Tracks (layer width: path | path; a pad name or v marks a point on that pad's centre or on a via)
3V3_EN  (via drill 0.2)
  Top 0.254: R102.P$2 27.82,47.16 29.22,47.16 29.64,47.59 R101.P$2 30.05,47.85 30.72,48.51 32.32,48.51 33.02,49.21 33.02,51.44 U$101.73
  Top 0.305: JP1.2 73.09,47.21 74.73,47.21 75.81,48.29 75.81,50 v74.6,51.21
  Horizontal 0.152: 55.74,53.76 63.82,53.76 63.82,53.65 | 55.74,53.76 35.35,53.76 U$101.73 | v56.98,28.46 57.67,29.15 57.67,29.76 v61.26,32.99 | v55.87,53.3 55.87,53.64 55.74,53.76
  Horizontal 0.305: 63.82,53.76 69.41,53.76 69.77,54.13 73.14,54.13 74.6,52.67 v74.6,51.21
  Vertical 0.152: v56.88,20.59 v56.98,28.46 | v61.26,32.99 61.26,44.35 55.87,49.75 v55.87,53.3
  Bottom 0.127: U502.5 56.84,20.64 v56.88,20.59
  Bottom 0.254: 56.83,20.04 v56.88,20.59
  Bottom 0.305: 56.83,20.04 R503.P$2 | U502.4 58.44,20.95 58.03,20.54 56.94,20.54 v56.88,20.59
!ACCEL_MAG_CS  (via drill 0.2)
  Top 0.15: v41.71,20.73 41.2,20.73 40.44,19.71 40.44,19.06 JP402.2
  Horizontal 0.15: v42.72,26.31 v41.71,26.31
  Horizontal 0.152: v45.88,41.3 45.85,41.27 v42.67,41.27
  Vertical 0.15: v42.72,33.71 v42.72,26.32 v42.72,26.31 | v41.71,26.31 v41.71,20.73
  Vertical 0.152: U$101.63 46.99,52.57 45.88,51.46 45.88,51.19 45.91,51.16 45.91,41.33 v45.88,41.3 | 42.61,41.01 42.61,40.83 | 42.61,40.83 42.73,33.66 v42.72,33.71 | v42.67,41.27 42.72,40.83 42.61,40.83
!ACCEL_MAG_CS_EXT
  Top 0.15: FPC_401.6 44.25,13.61 43.23,12.6 39.42,12.6 39.42,16.24 JP402.3
!ACCEL_MAG_CS_INT  (via drill 0.2)
  Top 0.15: JP402.1 39.17,20.47 37.9,21.74 35.86,21.74 35.1,22.5 35.1,26.31 v34.34,27.08
  Bottom 0.15: v34.34,27.08 35.19,27.08 U406.20
!FRAM_CS
  Bottom 0.152: U102.1 30.66,16.09 31.55,15.14 35.61,11.07 35.61,3.71 36.12,3.2 53.39,3.2 U$101.12
!GYRO_CS  (via drill 0.2)
  Top 0.254: v36.88,19.46 35.31,17.88 JP401.2
  Horizontal 0.152: v56.18,19.46 55.68,18.95 54.66,18.95 54.21,19.4 53.14,19.4 v36.88,19.46
  Vertical 0.15: 55.27,12.97 55.27,18.54 v56.18,19.46
  Vertical 0.152: U$101.9 57.12,4.47 57.07,9.02 55.3,10.89 55.27,12.97
!GYRO_CS_EXT
  Top 0.15: JP401.3 36.2,16.49 36.88,17.17 39.93,17.17 40.69,16.41 40.69,14.12 41.2,13.61 43.57,13.61 43.86,13.93 FPC_401.7
!GYRO_CS_INT  (via drill 0.2)
  Top 0.254: JP401.1 34.57,19.22 34.59,19.2
  Top 0.406: v33.76,19.2 34.59,19.2
  Vertical 0.152: 33.27,25.17 v33.28,26.55 33.28,25.18 33.27,25.17 | 33.27,25.17 33.23,19.6 33.63,19.2 v33.76,19.2
  Bottom 0.152: U406.19 v33.29,26.56
  Bottom 0.254: v33.29,26.56 v33.28,26.55
!LED_AMBER  (via drill 0.2)
  Top 0.152: v35.57,50.81 35.57,51.45 U$101.71
  Bottom 0.152: R610.P$1 37.6,44.44 35.57,46.46 v35.57,50.81
!LED_BLUE  (via drill 0.2)
  Top 0.254: U$101.61 49.53,52.67 48.22,51.36 48.22,45.66 46.97,44.41 v46.97,43.06
  Bottom 0.254: v46.97,43.06 42.47,43.06 R612.P$1
!LED_SAFETY  (via drill 0.2)
  Horizontal 0.254: v22.15,33.93 22.15,33.43 21.64,32.92 20.88,32.92 19.61,31.65 19.61,20.73 20.12,20.22 20.12,10.06 22.66,7.52 26.47,7.52 27.74,8.79 31.55,8.79 32.94,9.68 v32.82,9.8
  Vertical 0.254: U$101.26 36.65,1.91 35.61,2.95 35.61,7.26 33.07,9.8 v32.82,9.8
  Bottom 0.254: R611.P$2 22.93,34.21 22.66,33.93 v22.15,33.93
!SBUS_OUTPUT_EN  (via drill 0.2)
  Horizontal 0.254: U$101.11 54.61,4.42 53.64,3.2 51.36,3.2 50.85,3.71 50.85,4.98 50.34,5.49 48.56,5.49 48.06,6.25 44.5,6.25 43.74,7.01 40.94,7.01 39.93,8.03 33.32,8.03 v32.82,8.79
  Vertical 0.15: v24.43,39.52 24.43,32.16 24.94,31.65 24.94,19.96 26.21,18.69 26.21,17.42 25.45,16.66 25.45,11.33 26.72,10.06 29.77,10.06 31.09,8.81
  Vertical 0.254: v32.82,8.79 31.29,8.79 31.09,8.81
  Bottom 0.15: U703.7 23.69,41.79 24.18,41.3 24.18,39.78 v24.43,39.52
!VDD_5V_HIPOWER_OC  (via drill 0.2)
  Horizontal 0.152: U$101.19 43.11,5.78 16.91,5.78 16.82,5.87 16.82,11.69 16.49,12.02 7.35,12.02 4.21,15.16 v4.21,15.2
  Vertical 0.152: v4.21,15.2 3.78,15.64 v3.78,24.27
  Bottom 0.254: R502.P$1 v3.78,24.27 3.96,24.39 U501.4
!VDD_5V_PERIPH_EN  (via drill 0.2, 0.6)
  Horizontal 0.152: v68.25,48.84 68.22,48.74 56.46,48.74 55.04,50.17 U$101.58 53.26,51.51 10,51.51 9.93,51.44 v6.6,51.44 | v69.28,37.09 69.56,37.09 69.93,36.72 73.99,36.72 74.33,36.38 v76.13,36.38
  Vertical 0.152: v68.25,48.84 68.31,48.77 68.35,47.28 68.38,43.54 69.21,42.47 69.21,40.87 69.21,41.57 69.21,38.37 v69.28,37.09 | v6.6,51.44 5.91,51.44 arc90 3.19,48.72 3.25,30.71 arc90 v5.18,28.12
  Bottom 0.15: R506.P$1 75.49,35.97 U503.5
  Bottom 0.254: U503.5 75.76,36.02 v76.13,36.38
  Bottom 0.406: v5.18,28.12 6.21,27.08 6.21,25.43 6.89,24.44 U501.5
!VDD_5V_PERIPH_OC  (via drill 0.2)
  Horizontal 0.152: v72.98,36.19 70.23,36.23 v70.21,36.21 | v70.25,35.5 60.26,35.5 v55.65,30.79
  Vertical 0.15: 54.86,19.17 54.86,14.39 53.24,12.77
  Vertical 0.152: v55.65,30.79 55.65,27.99 56.16,27.48 56.16,26.83 54.86,25.53 54.86,19.17 | 53.24,12.79 53.24,12.77 52.92,12.49 52.92,5.34 U$101.13
  Bottom 0.254: U503.4 73.46,36.02 v72.98,36.19 | v70.21,36.21 70.21,34.6 R507.P$1 70.14,35.3 v70.25,35.5
!VDD_SERVO_IN_FAULT  (via drill 0.2)
  Horizontal 0.152: U$101.18 46.93,1.91 45.65,0.62 10.95,0.62 9.32,2.25 v9.32,7.68
  Bottom 0.254: v9.32,7.68 U801.4
ACCEL_DRDY  (via drill 0.2)
  Top 0.15: FPC_401.3 45.85,20.14 v46.02,21.74
  Horizontal 0.15: v37.64,20.98 38.91,20.98 39.67,21.74 v46.02,21.74 55.68,21.74 56.12,21.55 v56.12,21.36
  Vertical 0.152: v37.64,20.98 37.62,25.33 v37.63,25.33 | U$101.8 59.69,2.18 58.52,3.34 58.52,8.36 58.47,8.53 55.68,11.33 55.68,18.19 56.69,19.2 56.69,19.71 56.37,20.03 v56.12,21.36
  Bottom 0.152: v37.63,25.33 37.63,25.98 U406.14
ALARM  (via drill 0.2)
  Vertical 0.406: v24.94,11.58 24.94,17.17 25.7,17.68 25.7,18.44 24.43,19.71 24.43,29.62 22.91,31.14 22.91,39.01 24.18,40.28 24.18,42.82 22.91,44.09 22.91,46.38 23.67,47.14 26.72,47.14 v28.5,45.87
  Bottom 0.406: U$101.36 24.16,1.91 25.45,3.2 25.45,6.5 26.72,7.77 26.72,9.8 v24.94,11.58 | v28.5,45.87 27.98,45.87 R602.P$2
AUX_ADC1  (via drill 0.2)
  Horizontal 0.152: v51.68,48.45 24.11,48.45 v22.84,49.65
  Vertical 0.152: v51.56,46.38 51.56,47.95 v51.68,48.45 | v22.84,49.65 22.84,51.45 U$101.83
  Bottom 0.254: R308.P$1 50.96,46.99 v51.56,46.38
AUX_ADC2  (via drill 0.2)
  Horizontal 0.152: U$101.84 21.59,49.37 22.63,48.32 22.63,47.46 23.03,47.06 24.41,47.06 24.6,47.25 29.77,47.26 31.29,45.6 47.8,45.63 48.3,46.13 49.4,47.28 v52.13,47.26
  Bottom 0.254: v52.13,47.26 52.75,47.02 R307.P$1
BACKUP_LIPO_+_1S
  Vertical 0.61: U$101.TP5 75.15,43.94 79.93,48.73 79.93,52.56 X801.1
BATT_CURRENT_SENS  (via drill 0.2)
  Top 0.254: v75.26,53.9 25.26,53.83 U$101.81
  Bottom 0.152: R808.P$1 79.46,39.33 78.51,39.4
  Bottom 0.254: R804.P$1 77.94,37.2 78.38,37.63 78.38,38.35 78.51,38.48 78.51,39.4 78.51,46.25 75.3,49.46 75.3,51.95 v75.26,53.9
BATT_CURRENT_SENS_PROT  (via drill 0.2)
  Top 0.61: J801.3 76.89,42.1 v77.03,41.95
  Vertical 0.813: v71.19,37.36 73.46,37.36 73.58,37.49 73.58,38.67 75.3,40.38 76.82,41.91 v77.03,41.95
  Bottom 0.254: R802.P$1 72.03,36.53 71.93,36.98 L801.P$1
  Bottom 0.61: v71.19,37.36 71.24,37.31 72.03,36.53
BATT_SENSE
  Power 0.61: U$101.TP6 75.53,46.48 78.6,49.56 78.6,52.47 X801.2
BATT_TEMP_SENSE
  Vertical 0.61: X801.3 77.48,49.32 73.39,45.24 71.02,45.24 U$101.TP7
BATT_VOLTAGE_SENS  (via drill 0.2)
  Horizontal 0.152: v85.71,38.76 85.2,39.27 78.28,39.27 77.9,38.89 v77.63,38.89
  Bottom 0.152: R807.P$1 85.39,39.27 v85.71,38.76
  Bottom 0.254: R805.P$1 v77.63,38.89 77.63,45.69 75.5,47.83 71.51,47.83 67.97,51.36 25.33,51.36 U$101.82
BATT_VOLTAGE_SENS_PROT  (via drill 0.2)
  Top 0.61: v73.61,42.73 73.61,42.99 73.87,43.25 74.93,43.25 J801.4
  Bottom 0.305: R801.P$1 73.46,37.98 L802.P$1
  Bottom 0.61: L802.P$1 74.1,42.25 v73.61,42.73
BBB-VDD_3V3  (via drill 0.2, 0.6 pad 1.27)
  Top 0.254: 23.87,39.71 23.87,38.96 D601.C | U$12.1 20.49,33.58 v19.69,33.04
  Top 0.305: 25.14,37.53 D601.C | 23.87,39.71 v23.46,40.38
  Top 0.406: v26.55,32.84 29.68,32.75 VDD_3V901.P$1
  Horizontal 0.15: v21.03,25.97 21.07,26 21.84,26.79 22.06,26.82 22.91,26.82 v23.29,27.2
  Horizontal 0.152: v4.92,19.48 6.44,19.48 8.12,17.1 8.15,17.1 v8.09,17.05
  Vertical 0.254: v47.85,13.57 47.85,10.18 v46.92,9.24
  Vertical 0.305: v20.75,46.38 20.75,44.92 22.97,42.7 22.97,40.66 v23.46,40.38
  Power 0.254: v59.43,21.02 59.61,20.43 59.58,20.4 59.58,20.71 59.73,20.86
  Bottom 0.15: v46.92,9.24 46.84,9.24 | U701.19 19.2,17.68 19.61,17.68 19.73,17.56 20.48,17.56 20.48,19.09 19.34,20.49 19.34,21.56 | U701.2 22.45,17.68 21.89,17.68 | 20.47,25.8 20.38,25.71 20.37,25.71 | C201.P$1 21.05,26.06 v21.03,25.97 | 68.38,12.85 68.62,12.61 R305.P$1 67.88,10.84 U303.8 U303.7 U303.2 69.99,10.49 R302.P$2 R301.P$2 | 66.85,8.28 67.11,8.03 67.11,6.88 C303.P$1 | 66.85,8.28 65.58,8.28 64.57,9.3 64.18,9.3 63.58,9.9 63.55,10.5 U301.3 | R304.P$1 68.62,8.53 68.38,8.28 66.85,8.28 | v22.91,13.36 22.02,13.36 U701.10 | C302.P$1 63.82,12.6
  Bottom 0.152: U201.10 20.47,25.8 | C201.P$1 20.53,25.81 20.43,25.71 20.37,25.71 19.84,25.71 R719.P$2 18.49,26.07 C703.P$1 | 61.73,29.73 U601.1 | R215.P$2 23.93,32.07 v23.64,31.77 | C202.P$1 53.82,11.56 R216.P$2 | R314.P$2 C701.P$1 | R718.P$2 24.18,28.09 v23.29,27.2 22.91,26.82 22.34,26.82 22.09,27.04 21.78,27.32 U702.10
  Bottom 0.25: v59.43,21.02 60.1,20.35 C506.P$1 59.67,19.77 C507.P$1
  Bottom 0.254: v23.46,40.38 23.1,40.54 U703.8 | C302.P$1 63.81,11.43 63.59,11.21 63.57,10.55 U301.3 63.57,10.52 | U502.7 56.77,22.43 | 56.77,22.43 C601.P$1 | 19.34,21.56 U201.2 | U701.19 18.46,17.8 16.57,17.85 16.57,17.03 v8.09,17.05 | U701.2 22.07,17.8 | 21.32,14.06 U701.10 | 56.77,22.43 56.46,22.43 v55.98,22.85 | v52.69,13.01 51.6,11.93 U202.10 51.8,11.56 C202.P$1 | U202.2 47.55,13.36 47.76,13.57 v47.85,13.57 | U202.19 v46.92,9.24 | v19.69,33.04 19.22,33.04 18.85,32.66 18.85,31.65 18.98,31.47 U702.19 | U702.2 23.09,31.77 v23.64,31.77 | R502.P$2 3.13,21.27 v4.92,19.48 | R601.P$2 62.06,30.96 | 62.06,30.96 61.82,30.72 61.82,30.7 61.73,30.61 61.73,29.73 | v63.1,21.36 62.13,20.61 C505.P$1 | 61.81,25.4 60.23,26.97 60.23,30.66 60.22,30.67 60.22,32.61 | 61.81,25.4 v61.77,23.65 | U601.10 62.03,25.81 61.81,25.4 | 62.06,30.96 62.06,30.95 61.72,30.61 60.28,30.61 | R507.P$2 68.52,34.66 | 60.22,32.61 60.22,33.01 61.78,34.64 68.12,34.64 | 60.22,32.61 59.72,32.61 58.72,33.06 58.72,38.46 61.17,38.46 U302.2 61.27,38.46 61.72,38.46 61.97,38.71 61.97,42.16 U302.10 | U201.19 22.98,21.45 v22.98,20.96 | 21.89,17.68 21.89,14.12 U701.10 | 20.48,17.56 20.48,14.9 U701.10
  Bottom 0.305: C701.P$1 21.58,12.85 U701.10 | 68.12,34.64 68.52,34.66 | 60.28,30.61 60.23,30.66 | C702.P$1 21.11,46.74 v20.75,46.38 | 63.82,12.6 66.34,13.61 | v66.68,13.19 68.55,13.11 68.38,12.85 | C303.P$1 67.23,6.76
  Bottom 0.406: C304.P$1 62.14,43.24 62.11,42.39 62.17,42.46 U302.10
  Bottom 1.27: v59.49,16.92 59.99,16.66 61.01,15.65 64.57,15.65 64.82,15.14 66.34,13.61 67.11,12.85 68.38,12.85
  pour Power (isolate 0.406, rank 6): 61.25,44.74 61.25,16.66 77.77,16.66 78.04,-0.76 17.21,-0.63 17.63,44.31
  pour Power: 27.69,19.73 32.77,15.09 52.42,14.97 54.85,17.47 54.81,23.57 55.74,23.57 55.74,23.56 55.87,23.56 55.87,22.95 56.66,22.95 56.66,22.9 56.67,20.99 61.86,21.15 61.86,24.73 63.33,24.73 63.14,16.42 60.26,16.26 55.25,12.77 26.45,12.77 26.09,19.68
CAN1_RX_1  (via drill 0.2)
  Horizontal 0.152: v64.82,10.57 62.03,10.57 60.5,9.04 57.71,9.04 55.68,11.07 55.68,13.36 54.66,14.38 53.9,14.38 53.14,15.14 v49.61,15.14 49.58,15.14
  Vertical 0.152: v48.4,44.99 48.4,17.08 49.58,15.9 v49.61,15.14
  Bottom 0.254: v49.61,15.14 U202.6 | U301.4 64.24,10.69 64.24,10.7 64.24,10.56 v64.82,10.57 | v48.4,44.99 48.4,45.28 45.07,48.61 40.92,48.61
CAN1_TX_1  (via drill 0.2)
  Horizontal 0.152: v39.93,44.39 40.35,44.39 40.55,44.59 47.57,44.61 47.62,44.56 47.8,44.39 v47.85,44.34 | v58.98,15.9 58.72,15.9 56.69,17.93 50.85,17.93 v49.82,16.81
  Vertical 0.152: v47.85,44.34 47.85,35.25 arc-90 47.4,34.84 47.5,24.15 47.91,23.74 47.9,16.85 49.07,15.65 49.07,14.38 49.89,13.55 v50.13,13.55 50.08,13.56 50.08,16.12 49.82,16.44 v49.82,16.81 | v62.28,9.3 62.28,13.11 59.99,15.9 v58.98,15.9
  Bottom 0.254: 36.83,50.17 38.07,48.92 38.07,46.1 39.47,45.21 39.93,44.75 v39.93,44.39 | v50.13,13.55 50.09,12.94 U202.7 | U301.1 62.29,10.17 v62.28,9.3
CAN_H  (via drill 0.2)
  Top 0.254: 61.34,18.44 61.32,18.44 J307.2 61.1,18.36 CAN_H.P$1 58.22,18.26 58.22,15.65 58.47,15.39 59.74,15.39 61.52,13.61 61.52,12.6 62.9,11.21 v62.9,9.25
  Top 0.305: 61.34,18.44 60.74,18.67
  Bottom 0.15: v62.9,9.25 62.9,8.22 U301.7
  Bottom 0.254: U301.7 62.94,7.11 R309.P$1
CAN_L  (via drill 0.2)
  Top 0.254: 61.33,19.81 61.3,19.81 J307.3 | v63.55,9.24 63.54,11.6 62.28,12.85 62.28,15.9 62.79,16.41 63.3,16.41 63.55,16.66 63.55,18.95 62.79,19.71 61.31,19.71 J307.3 | CAN_L.P$1 58.29,20.14 58.72,19.71 61.2,19.71 J307.3
  Bottom 0.15: v63.55,9.24 63.54,8.23 U301.6
  Bottom 0.254: U301.6 63.59,7.26 R309.P$2 64.38,6.19
CH_1  (via drill 0.2)
  Vertical 0.15: U$101.28 33.07,3.12 33.07,5.23 29.26,9.04 26.21,9.04 25.45,9.8 24.43,9.8 23.93,10.31 v23.93,13.87
  Bottom 0.15: U701.5 23.27,16.3 23.27,14.52 v23.93,13.87
CH_1_OUT
  Bottom 0.15: U701.16 18.23,16.3 18.08,16.15 18.08,12.34 R714.P$1
CH_2  (via drill 0.2)
  Vertical 0.15: 34.29,4.7 29.51,9.47 29.51,9.55 26.47,9.55 25.7,10.31 24.94,10.31 24.43,10.82 24.43,14.12 24.18,14.38 v24.18,14.63
  Vertical 0.152: 34.29,4.7 U$101.27
  Bottom 0.15: U701.4 22.69,16.92 23.93,16.92 24.18,16.66 v24.18,14.63
CH_2_OUT
  Bottom 0.15: U701.17 17.97,16.8 17.58,16.41 17.58,14.37 R713.P$1
CH_3  (via drill 0.2)
  Vertical 0.15: U$101.30 30.53,3.12 30.53,5.99 30.02,6.5 28.75,6.5 27.74,7.52 24.94,7.52 22.4,10.06 22.4,16.66 v23.42,17.68
  Bottom 0.15: U701.3 23.04,17.3 v23.42,17.68
  Bottom 0.152: U701.3 22.59,17.32
CH_3_OUT
  Bottom 0.15: U701.18 17.45,17.3 16.81,16.66 R712.P$1
CH_4  (via drill 0.2)
  Vertical 0.15: U$101.29 31.55,4.65 31.55,6.25 29.26,8.53 24.69,8.53 23.42,9.8 23.42,16.66 23.93,17.17 23.93,18.19 v23.67,18.44
  Bottom 0.15: v23.67,18.44 21.72,18.44 U701.1
CH_4_OUT
  Bottom 0.15: R701.P$1 19.43,18.95 U701.20
CH_5  (via drill 0.2)
  Vertical 0.15: U$101.40 18.08,2.87 18.08,7.77 18.34,8.03 18.34,27.84 18.85,28.35 v21.89,28.35
  Bottom 0.15: v21.89,28.35 22.27,27.97 U702.9
CH_5_OUT
  Bottom 0.15: U702.12 18.72,27.97 17.83,27.08 17.83,22.24 R702.P$1
CH_6  (via drill 0.2)
  Vertical 0.15: U$101.39 18.85,4.65 18.85,17.93 19.35,18.44 19.35,18.69 19.86,19.2 19.86,23.52 18.85,24.54 18.85,27.58 19.1,27.84 23.16,27.84 v23.67,28.35
  Bottom 0.15: v23.67,28.35 23.55,28.47 U702.8
CH_6_OUT
  Bottom 0.15: U702.13 18.13,28.47 17.72,28.06 17.72,27.54 17.42,27.25 17.42,24.37 R703.P$1
CH_7  (via drill 0.2)
  Vertical 0.15: U$101.42 16.51,2.64 17.58,3.71 17.58,8.03 17.83,8.28 17.83,28.09 18.59,28.85 v21.5,28.83
  Bottom 0.15: v21.5,28.83 21.75,28.97 U702.7
CH_7_OUT
  Bottom 0.15: U702.14 18.01,28.97 17.4,28.36 17.4,27.75 16.93,27.28 16.93,26.43 R704.P$1
CH_8  (via drill 0.2)
  Vertical 0.15: U$101.41 16.51,7.98 17.32,8.79 17.32,28.35 18.34,29.36 v21.13,29.36
  Bottom 0.15: v21.13,29.36 22.66,29.36 U702.6
CH_8_OUT
  Bottom 0.15: U702.15 17.18,29.47 R705.P$1
CH_9  (via drill 0.2)
  Vertical 0.15: U$101.44 13.97,2.13 15.29,3.45 15.29,7.52 16.81,9.04 16.81,28.6 18.08,29.87 v20.37,29.87
  Bottom 0.15: v20.37,29.87 20.47,29.97 U702.5
CH_9_OUT
  Bottom 0.15: U702.16 18.23,29.97 R706.P$1
CH_10  (via drill 0.2)
  Vertical 0.15: U$101.43 13.97,6.96 16.31,9.3 16.31,29.11 17.89,30.54 v20.15,30.54
  Bottom 0.15: v20.15,30.54 20.53,30.47 U702.4
CH_10_OUT
  Bottom 0.15: U702.17 18.5,30.47 17.58,31.39 17.58,32.66 R707.P$1
CH_11  (via drill 0.2)
  Vertical 0.15: 11.43,2.64 12.75,3.96 12.75,8.79 13.77,9.8 13.77,29.36 14.27,29.87 16.31,29.87 17.83,31.14 v20.37,31.14
  Vertical 0.152: U$101.46 11.43,2.64
  Bottom 0.15: v20.37,31.14 21.56,30.97 U702.3
CH_11_OUT
  Bottom 0.15: U702.18 18.76,30.97 18.08,31.65 18.08,35.45 R708.P$1
CH_12  (via drill 0.2)
  Vertical 0.15: 11.86,4.98 11.86,9.17 11.23,9.8 11.23,31.9 11.73,32.41 20.37,32.41 v21.34,33.64
  Vertical 0.152: U$101.45 11.43,4.55 11.86,4.98
  Bottom 0.15: v21.34,33.64 21.34,32.41 U702.1
CH_12_OUT
  Bottom 0.15: U702.20 20.28,35.79 R709.P$1
FMU-CH6-PROT
  Bottom 0.15: R708.P$2 15.29,35.97 U704.31
FMU-VDD_5V5
  Bottom 0.254: C502.P$1 arc90 60.41,23.48 L501.P$2 arc-90 58.49,23 | 58.49,23 U502.1 | 59.47,21.5 arc90 C501.P$1 arc90 58.86,23 58.49,23
FMU_AUX_ADC1_PROT  (via drill 0.2)
  Top 0.254: v50.32,45.38 50.39,44.31
  Top 0.305: J309.4 50.43,44.28 50.39,44.31
  Bottom 0.254: R308.P$2 50.36,45.29 v50.32,45.38
  Bottom 0.305: R311.P$2 50.32,44.43 v50.32,45.38
FMU_AUX_ADC2_PROT  (via drill 0.2)
  Top 0.254: v53.36,45.27 52.97,44.23
  Top 0.305: J309.2 52.93,44.19 52.97,44.23
  Bottom 0.254: R307.P$2 52.89,44.17 v53.36,45.27
  Bottom 0.305: R310.P$2 52.85,44.31 v53.36,45.27
GND  (via drill 0.2)
  Top 0.15: FPC_401.2 46.35,13.43 45.77,12.85 L203.P$5 | U$201.P$7 U$2.P$8 21.67,17.67 U$2.6 | D706.A 17.06,7.63 v15.75,6.32 | U$201.6 20.51,28.14 v21.09,27.38 | 31.22,9.55 U$3.P$8 | U$4.6 46.1,6.94 v45.98,7.23 | U$3.P$7 U$4.P$8 41.62,9.64 v40.94,10.31 | U$4.P$7 53.56,9.64 v53.39,9.8
  Top 0.152: L202.P$3 28.42,8.46 28.5,9.55 31.22,9.55
  Top 0.254: 62.7,42.6 v64.74,42.57 | 49.08,44.26 v49.08,45.42 | GND..P$1 58.11,35.39 v57.64,35.39 | v67.96,37.77 67.95,37.76 GND.P$1 | 26.16,47.69 R102.P$1 26.22,47.62 v23.3,47.62 23.19,47.74 U$11.P$4 | 26.24,34.95 R613.P$2 26.22,35.16 v26.22,36.01 D601.A | L202.P$4 L202.P$5 L202.P$3 | v62.32,21.87 61.16,21.11 J307.4 | 59.25,8.03 L303.P$5 61,8.02 J314.P$6 | 64.06,23.46 64.06,22.5 64.82,21.74 64.82,20.47 64.06,19.71 64.06,14.81 J307.P$5 | v20.12,46.38 20.12,45.85 U$11.2 | v21.32,43.2 21.76,43.2 U$11.P$3 U$12.P$5 | U$201.P$8 U$12.P$4 24.09,32.37 24.31,32.16 v24.31,31.43 | v23.67,20.47 23.16,20.47 22.02,19.33 21.89,19.2 | J314.4 63.45,7.4 63.47,7.17 63.46,5.59 65.59,5.6 65.89,5.29 v66.01,5.29 | J314.P$5 69.65,11.34 v69.9,11.58 | v69.9,11.58 70.15,11.84 70.41,11.84 | 70.41,11.84 71.95,11.84 J306.4 | v69.9,11.58 70.15,11.58 70.41,11.84 | J310.4 81.7,11.68 J310.P$6 | J310.P$5 82.87,6.76 76.5,6.76 75.48,5.73 74.3,5.73 74.3,5.72 U$101.P$3
  Top 0.305: C801.P$2 67.98,38.5 v67.96,37.77 | J305.3 62.68,43.76 62.7,42.6 | J305.P$4 69.48,46.72 U$101.TP8 | J305.P$5 62.32,46.72 L301.P$5 | J308.4 63.02,38.92 v64.63,37.31 | J308.P$6 63.89,42.09 v64.74,42.57 | J309.P$7 44.72,46.72 U$101.93 | J309.5 49.18,44.16 49.08,44.26 | J309.3 51.66,44.02 51.61,43.97 v51.61,45.36 | J309.P$6 54.96,46.72 54.91,46.76 54.91,47.89 L302.P$5 | 22.93,48 v23.3,47.62
  Top 0.406: v25.27,9.26 25.48,9.26 D202.A | U$101.TP8 69.74,46.48 | J307.P$5 63.27,14.81 v63.27,13.41 | 64.06,23.46 J307.P$6 | L201.P$3 L201.P$5 L201.P$4 18.08,19.46 D201.A | U$2.P$7 27.77,6.52 L202.P$4 | U$201.P$7 21.92,19.43 22.02,19.33
  Top 0.61: J701.P$2 82.47,44.12 82.44,44.14 79.17,44.14 78.72,44.6 J801.5 75.02,45.21 | 75.02,45.21 J801.6 | 69.74,46.48 69.75,46.48 71.02,45.21 75.02,45.21 | 72.81,11.74 72.9,11.74 v73.46,12.6 | 72.81,11.74 J306.P$6 | J306.4 72.81,11.74 | J308.P$5 63.89,30.69 v64.35,30.23
  Top 1.016: U704.42 U704.39 9.94,41.08 9.94,38.83 10.06,38.72 U704.36 9.99,38.59 9.99,37.38 10.06,37.32 U704.33 U704.30 U704.27 U704.24 U704.21 U704.18 U704.15 | U704.12 U704.9 U704.6 U704.3
  Top 1.27: J310.P$6 J310.P$5 | J306.P$5 74.3,5.73
  Ground 0.15: v36.88,20.98 36.63,20.98 | v47.04,20.98 47.29,20.98 | v40.18,16.15 40.44,16.41 | v45.98,7.23 45.52,7.26 | v40.94,10.31 40.94,10.57
  Ground 0.152: v53.39,9.8 53.2,9.81 53.2,8.22 54.98,6.25 | v27.04,16.85 27.04,16.73 27.23,16.54
  Ground 0.254: v51.06,25.47 51.06,25.43 51.43,25.43 | 39.27,26.17 39.24,26.17 | 61.66,12.45 64.39,12.45 | v9.22,24.68 7.41,25.15 7.86,24.97 | v64.63,37.31 63.27,37.28 63.27,37.29
  Ground 0.305: v57.75,24.29 57.4,24.29 | v50.63,20.93 50.71,20.93 50.76,20.98 50.76,20.97 | v66.26,41.21 66.26,44.28 65.96,44.33 | v51.61,45.36 51.87,45.62 | v30.53,20.92 30.91,21.77 v31.24,22.22
  Ground 0.406: 28.24,34.44 28.24,34.87 28.21,34.9
  Ground 0.61: X801.4 72.92,52.6 U$101.P$4
  Ground 1.016: U704.3 10.06,10.69 U$101.P$1 | U704.42 10.06,43.92 U$101.P$2 9.52,48.26 U$101.92 U$101.90 U$101.89
  Ground 1.93: U$101.91 U$101.89 | U$101.P$3 U$101.2 U$101.1 | U$101.P$4 U$101.47 U$101.48
  Power 0.254: v57.89,28.52 57.89,28.55 58.2,28.86 v58.2,29.34
  Bottom 0.15: C804.P$2 79.31,36.42 v78.79,35.9 79.31,35.38 R806.P$1 | U1.4 37.77,20.09 v36.88,20.98 | U2.4 46.46,20.4 v47.04,20.98 | 39.17,17.17 38.79,17.55 U1.2 | 39.17,17.17 39.17,17.12 U1.1 | 39.17,17.17 v40.18,16.15 40.18,15.04 C101.P$2 | D203.A 41.37,12.51 40.94,12.09 v40.94,10.31 41.33,9.93 | U303.1 69.16,10.84 v69.9,11.58 | D301.A 73.73,12.33 v73.46,12.6 | C303.P$2 65.43,6.82 65.5,6.75 | U407.P$7 49.07,34.14 U407.P$1 51.24,33.54 v51.87,32.92
  Bottom 0.152: 74.64,35.52 U503.6 75.94,35.52 76,35.46 77.52,35.46 77.62,35.42 | L801.P$4 74.9,36.07 U503.P$3 | U405.20 v43.7,30.01 | U405.18 42.85,28.92 v42.11,29.14 | U405.11 43.69,25.47 v43.62,25.39 | v21.09,27.38 20.52,27.27 U702.11 20.28,27.24 19.86,27.08 19.49,27.08 R719.P$1 18.49,27.07 C703.P$2 | C408.P$2 29.91,22.82 v29.9,22.55 | C407.P$2 31.29,23.01 v31.24,22.22 | C406.P$1 35.65,23.31 v35.66,23.3 36.48,23.3 | U406.1 35.7,30.1 35.82,30.21 36.22,30.21 | 36.22,30.21 36.77,30.21 | 36.77,30.21 37.22,30.21 | 37.22,30.21 37.77,30.21 | 37.77,30.21 38.19,30.21 v38.34,30.37 38.2,30.23 U406.6 | U406.2 36.2,30.2 36.22,30.21 | U406.3 36.7,30.15 36.77,30.21 | U406.4 37.2,30.2 37.22,30.21 | U406.5 37.7,30.15 37.77,30.21 | C305.P$2 27.55,17.37 v27.04,16.85 | v79.33,38.37 80.18,38.37 80.19,38.38 80.19,38.9 R808.P$2 | R807.P$2 D703.A v82.97,38.61 | R215.P$1 24.31,32.28 v24.31,31.43 | R216.P$1 52.75,10.57 C202.P$2 | R314.P$1 20.29,11.33 20.33,11.29 | 20.28,27.35 20.28,27.12 | v26.99,27.99 R718.P$1
  Bottom 0.254: U602.4 23.27,47.1 R607.P$2 C604.P$2 23.3,48.25 | 20.14,45.85 C603.P$2 20.14,43.09 U703.4 | 20.14,45.85 R603.P$2 | 20.14,45.85 20.14,46.89 20.14,46.98 C702.P$2 v20.12,46.38 | U703.1 19.46,41.15 20.44,41.15 20.44,43.09 U703.4 | v21.32,43.2 19.48,43.1 U703.4 | 23.3,48.25 | 23.3,48.25 v23.3,47.62 | C301.P$2 R303.P$1 66.4,46.07 69.32,46.07 U$101.TP8 | C401.P$2 v33.47,35.46 | U403.11 v51.05,25.47 v51.06,25.47 | C415.P$2 47.79,25.8 v46.96,26.94 | C402.P$2 41.33,29.29 41.28,29.24 41.23,29.12 v41.81,28.08 | U502.2 57.64,22.5 U502.GND v57.64,21.1 | v55.33,19.62 arc-90 55.31,19.85 C503.P$1 | U301.2 63.04,11.33 63.3,11.58 63.3,12.09 62.94,12.45 62.94,12.48 arc90 C302.P$2 62.94,12.77 62.99,13.43 63.38,13.45 v63.27,13.41 | U301.5 65.5,6.88 65.5,6.75 65.47,5.75 65.92,5.29 v66.01,5.29 | C502.P$2 60.15,25.03 60.15,24.62 59.81,24.28 L501.P$3 | 64.36,30.19 v64.36,30.23 v64.35,30.23 64.35,29.74 64.32,29.71 64.06,29.36 U601.5 | C601.P$2 55.34,23.47 v55.33,24.28 | U801.2 10.74,6.69 U801.P$2 U801.GND | R803.P$1 15.33,6.74 v15.75,6.32 | L701.P$3 L701.P$5 L701.P$4 | U801.6 11.04,7.19 U801.P$3 | C701.P$2 20.24,11.37 20.33,11.29 22.47,9.14 24.9,9.14 v25.27,9.26 | U201.11 22.24,26.08 v22.24,26.39 22.05,26.59 C201.P$2 | v45.6,22.94 45.56,22.99 C410.P$2 | 82.3,37.18 U802.2 | v82.97,38.61 82.6,39.01 D703.A | C501.P$2 60.97,22 v60.97,22.59 | R802.P$2 72.51,35.02 U503.2 74.34,35.02 arc-90 U503.P$2 | v53.39,9.8 U202.11 51.9,10.56 C202.P$2 | C504.P$2 5.88,24.9 U501.P$3 6.03,23.89 U501.6 | U501.2 5.63,23.39 arc90 U501.GND U501.P$2 | U$101.80 27.89,48.94 28.77,48.94 29.08,48.63 29.22,48.63 29.69,48.16 C602.P$2 29.94,47.26 30.55,46.64 30.55,46.1 31.86,44.79 32.56,44.79 R608.P$1
  Bottom 0.254: L301.P$3 L301.P$5 L301.P$4 | R501.P$2 v9.22,24.68 | U702.11 20.28,27.35 | C507.P$2 58.43,17.77 v57.45,16.16 | C506.P$2 61.07,20.18 arc203 61.01,20.22 61.01,20.98 v62.32,21.87 | C505.P$2 61.92,18.6 v62.8,17.98 | R505.1 52.93,22.13 v52.63,22.5 | C509.P$2 58.07,28.35 v57.89,28.52 | v58.2,29.34 57.56,29.34 C508.P$2 | C510.P$2 64.38,37.28 v64.63,37.31 | v17.04,41.03 D702.A D701.A | U302.11 63.72,42.64 v64.74,42.57 | D303.A 60.2,7.98 L303.P$5 | L203.P$4 45.37,12.42 45.37,12.45 | U402.3 U402.4
  Bottom 0.305: U503.P$3 arc90 74.64,35.52 74.64,35.42 U503.GND U503.P$2 | 77.62,35.42 R506.P$2 R504.P$2 | L802.P$3 L802.P$5 L802.P$4 L801.P$3 L801.P$5 L801.P$4 | D302.A v49.08,45.43 v49.08,45.42 49.08,44.35 R311.P$1 | L302.P$3 L302.P$5 L302.P$4 | R509.P$2 63.8,31.9 64.31,31.39 64.31,30.12 64.36,30.19 | C701.P$2 20.08,12.68 U701.11 | L203.P$3 L203.P$5 L203.P$4 | 45.37,12.45 45.37,12.38 | C404.P$2 57.64,36.67 U401.2 U401.3 55.88,35.39 v57.64,35.39 | U403.1 v54.76,29.45 | L501.P$3 L501.P$5 L501.P$4 57.75,24.28 v57.75,24.29 | U403.18 49.87,29.44 v49.87,30.96 | C411.P$2 45.61,22.93 v45.6,22.94 | v46.96,26.94 46.99,26.92 48.24,25.67 48.24,24.55 C413.P$2 48.85,23.93 C412.P$2 | C414.P$2 49.56,21.59 50.25,20.9 50.6,20.9 v50.63,20.93 | C409.P$2 53.69,23 v52.63,22.5 | C416.P$2 52.63,32.16 v51.87,32.92 | R801.P$2 71.3,37.98 v71.24,38.36 | C802.P$2 66.01,39.87 C803.P$2 66.01,42.16 v66.26,41.21 | U102.4 30.52,20.02 v30.53,20.92 | R315.P$2 61.53,6.89 61.39,7.01 61.39,7.82 L303.P$4 L303.P$5 L303.P$3 60.02,7.98 D303.A | R716.P$1 7.95,19.2 v8.24,18.44 | R310.P$1 51.61,44.29 v51.61,45.36
  Bottom 0.406: C304.P$2 U302.11 | R605.P$1 64.77,22.59 v60.97,22.59 | C702.P$2 20.11,46.92 20.14,46.89 | U402.4 33.47,34.97 v33.47,35.46
  Bottom 0.61: C805.P$2 79.33,37.69 v79.33,38.37 | 82.32,37.25 U802.GND | 82.34,36.57 82.35,36.58 82.35,36.93 U802.GND 82.3,36.93 82.3,37.25 | 36.48,23.3 C405.P$1
  Bottom 1.016: U704.15 U704.12
  other vias: 57.71,23.52 82.35,35.46 82.35,38.25
  pour Ground (isolate 0.254): -1.68,58.12 9.19,56.98 90.07,57.09 89.06,-1.78 73.41,-2.2 -2.67,-1.37
  pour Bottom (isolate 0.254, rank 3): -2.74,55.78 87.17,55.27 87.68,32.92 67.11,32.92 67.11,15.9 86.66,15.9 86.66,-1.12 -3.76,-0.61
  pour Top (isolate 0.254): -3,54.76 87.68,54.76 87.68,32.66 66.85,32.66 66.85,15.9 86.92,15.9 87.17,-0.61 -3.51,-0.36
GYRO_DRDY  (via drill 0.2)
  Top 0.15: 44.85,14.47 FPC_401.5 44.85,13.71 43.23,12.09 38.91,12.09 v38.91,12.6
  Horizontal 0.152: v31.55,11.33 31.55,12.09 32.43,12.61 32.46,12.58 32.46,12.6 v38.91,12.6
  Vertical 0.15: v38.91,15.39 38.8,15.14 38.81,15.13
  Vertical 0.152: v38.81,24.51 38.83,24.4 38.79,22.48 v38.72,22.03 38.74,22.08 v38.91,15.39 38.81,15.13 v38.91,12.6
  Bottom 0.152: 26.67,2.23 27.58,3.14 29.77,3.14 30.53,3.9 30.53,10.25 30.98,10.69 v31.55,11.33
  Bottom 0.254: U$101.34 26.67,2.23 | v38.81,24.51 38.91,24.54 38.91,26.3 38.77,26.56 U406.12
I2C2_SCL  (via drill 0.2)
  Horizontal 0.15: v64.57,19.46 60.25,19.46 59.74,18.95 59.23,18.95 58.72,18.44 54.41,18.44 54.15,18.69 v53.64,18.69 53.39,18.95 v41.71,18.95
  Horizontal 0.152: v33.03,41.8 45.42,41.8 v45.47,41.85 45.54,41.78 v55.57,41.78
  Vertical 0.15: v29.26,38.26 29.51,38 30.53,38 31.8,38 32.56,38.76 | 64.57,13.87 70.41,8.03 v70.66,8.03
  Vertical 0.152: 64.57,13.87 v64.57,19.46 64.67,21.49 v64.6,28.04 | U$101.65 45.5,51.65 45.5,48.6 45.47,48.57 v45.47,41.85 | v33.03,41.8 32.56,41.3 32.56,38.76 | v30.05,31.24 30.53,31.39 30.53,38 | v63.04,30.12 63.04,30.63 59.11,34 59.11,38.19 v55.57,41.78
  Bottom 0.15: U2.6 53.52,18.82 v53.64,18.69 | U1.6 41.83,18.82 v41.71,18.95 | U303.3 70.58,10.05 R301.P$1 71.17,8.53 v70.66,8.03 | v29.26,38.25 v29.26,38.26
  Bottom 0.254: v64.6,28.04 63.04,28.09 U601.3 | v29.26,38.25 U402.8
  Bottom 0.305: U601.3 v63.04,30.12
I2C2_SDA  (via drill 0.2)
  Horizontal 0.15: v64.06,20.98 63.8,20.98 62.79,19.96 55.93,19.96 55.17,20.98 v52.37,20.98 51.36,19.96 v41.62,19.91
  Horizontal 0.152: v32.4,42.41 43.43,42.41 v43.43,42.38 43.48,42.32 v54.91,42.32
  Vertical 0.15: 64.06,13.61 64.06,13.36 69.39,8.28 v69.39,8.03
  Vertical 0.152: 64.06,13.61 v64.06,20.98 64.06,22.5 62.03,24.54 62.03,26.57 v62.27,30.1 61.33,30.1 58.66,32.9 58.66,37.92 54.62,41.83 54.62,42.04 v54.91,42.32 | U$101.66 43.43,49.15 v43.43,42.38 | v30.15,30.54 29.16,30.54 29.16,35.75 28.73,36.18 v28.73,36.85 v28.72,36.86 28.75,36.9 28.75,39.01 32.05,39.01 32.05,41.55 32.4,41.96 v32.4,42.41
  Bottom 0.15: U2.5 51.69,20.29 v52.37,20.98 | U1.5 41.83,20.09 v41.62,19.91 | U303.4 68.76,9.81 R302.P$1 70.15,8.79 v69.39,8.03
  Bottom 0.254: v28.72,36.86 29.32,37.37 29.83,37.47
  Bottom 0.305: U601.2 62.53,29.62 v62.27,30.1
  Bottom 0.61: U402.7 29.83,37.47
IO-CH1-PROT
  Bottom 0.15: R707.P$2 16.3,32.42 U704.28
IO-CH8-PROT
  Bottom 0.15: R712.P$2 15.79,15.15 U704.7
MAG_DRDY  (via drill 0.2)
  Top 0.15: 45.35,14.47 FPC_401.4 45.52,15.03 45.52,17.68 v45.01,18.19 | U$101.10 56.97,1.91 55.68,3.2 46.53,3.2 v45.77,3.96
  Horizontal 0.15: v36.88,18.19 36.88,17.93 44.75,17.93 44.9,18.04 v45.01,18.19
  Vertical 0.15: 38.17,20.82 38.15,19.2 v36.88,18.19 36.9,18.29 | v45.77,3.96 45.77,6.5 45.52,6.76 45.52,7.52 45.77,7.77 45.77,11.33 44.75,12.34 44.75,17.93 v45.01,18.19
  Vertical 0.152: v38.23,25.15 38.17,20.82
  Bottom 0.254: v38.23,25.15 38.23,26.03 U406.13
MPU_6000_DRDY  (via drill 0.2)
  Vertical 0.152: v50.86,24.87 51.28,24.87 51.61,24.59 51.67,12.91 51.67,9.64 52.37,8.93 52.37,7.77 51.67,7.07 51.67,6.12 50.85,5.3 50.85,3.12 U$101.14
  Bottom 0.152: v50.86,24.87 50.55,25.19 U403.12
MPU_6500_DRDY  (via drill 0.2)